# EasyEDA schematic SCH_Honda-GA-Net-Translator.json

## Sheets
1 Power Inlet: TITLE: Honda GA-Net Translator Power; REV: 1.0; Date: 2025-02-28; Sheet: 1/7; Drawn By: Aidan C Franits; Company: AidF Electronics
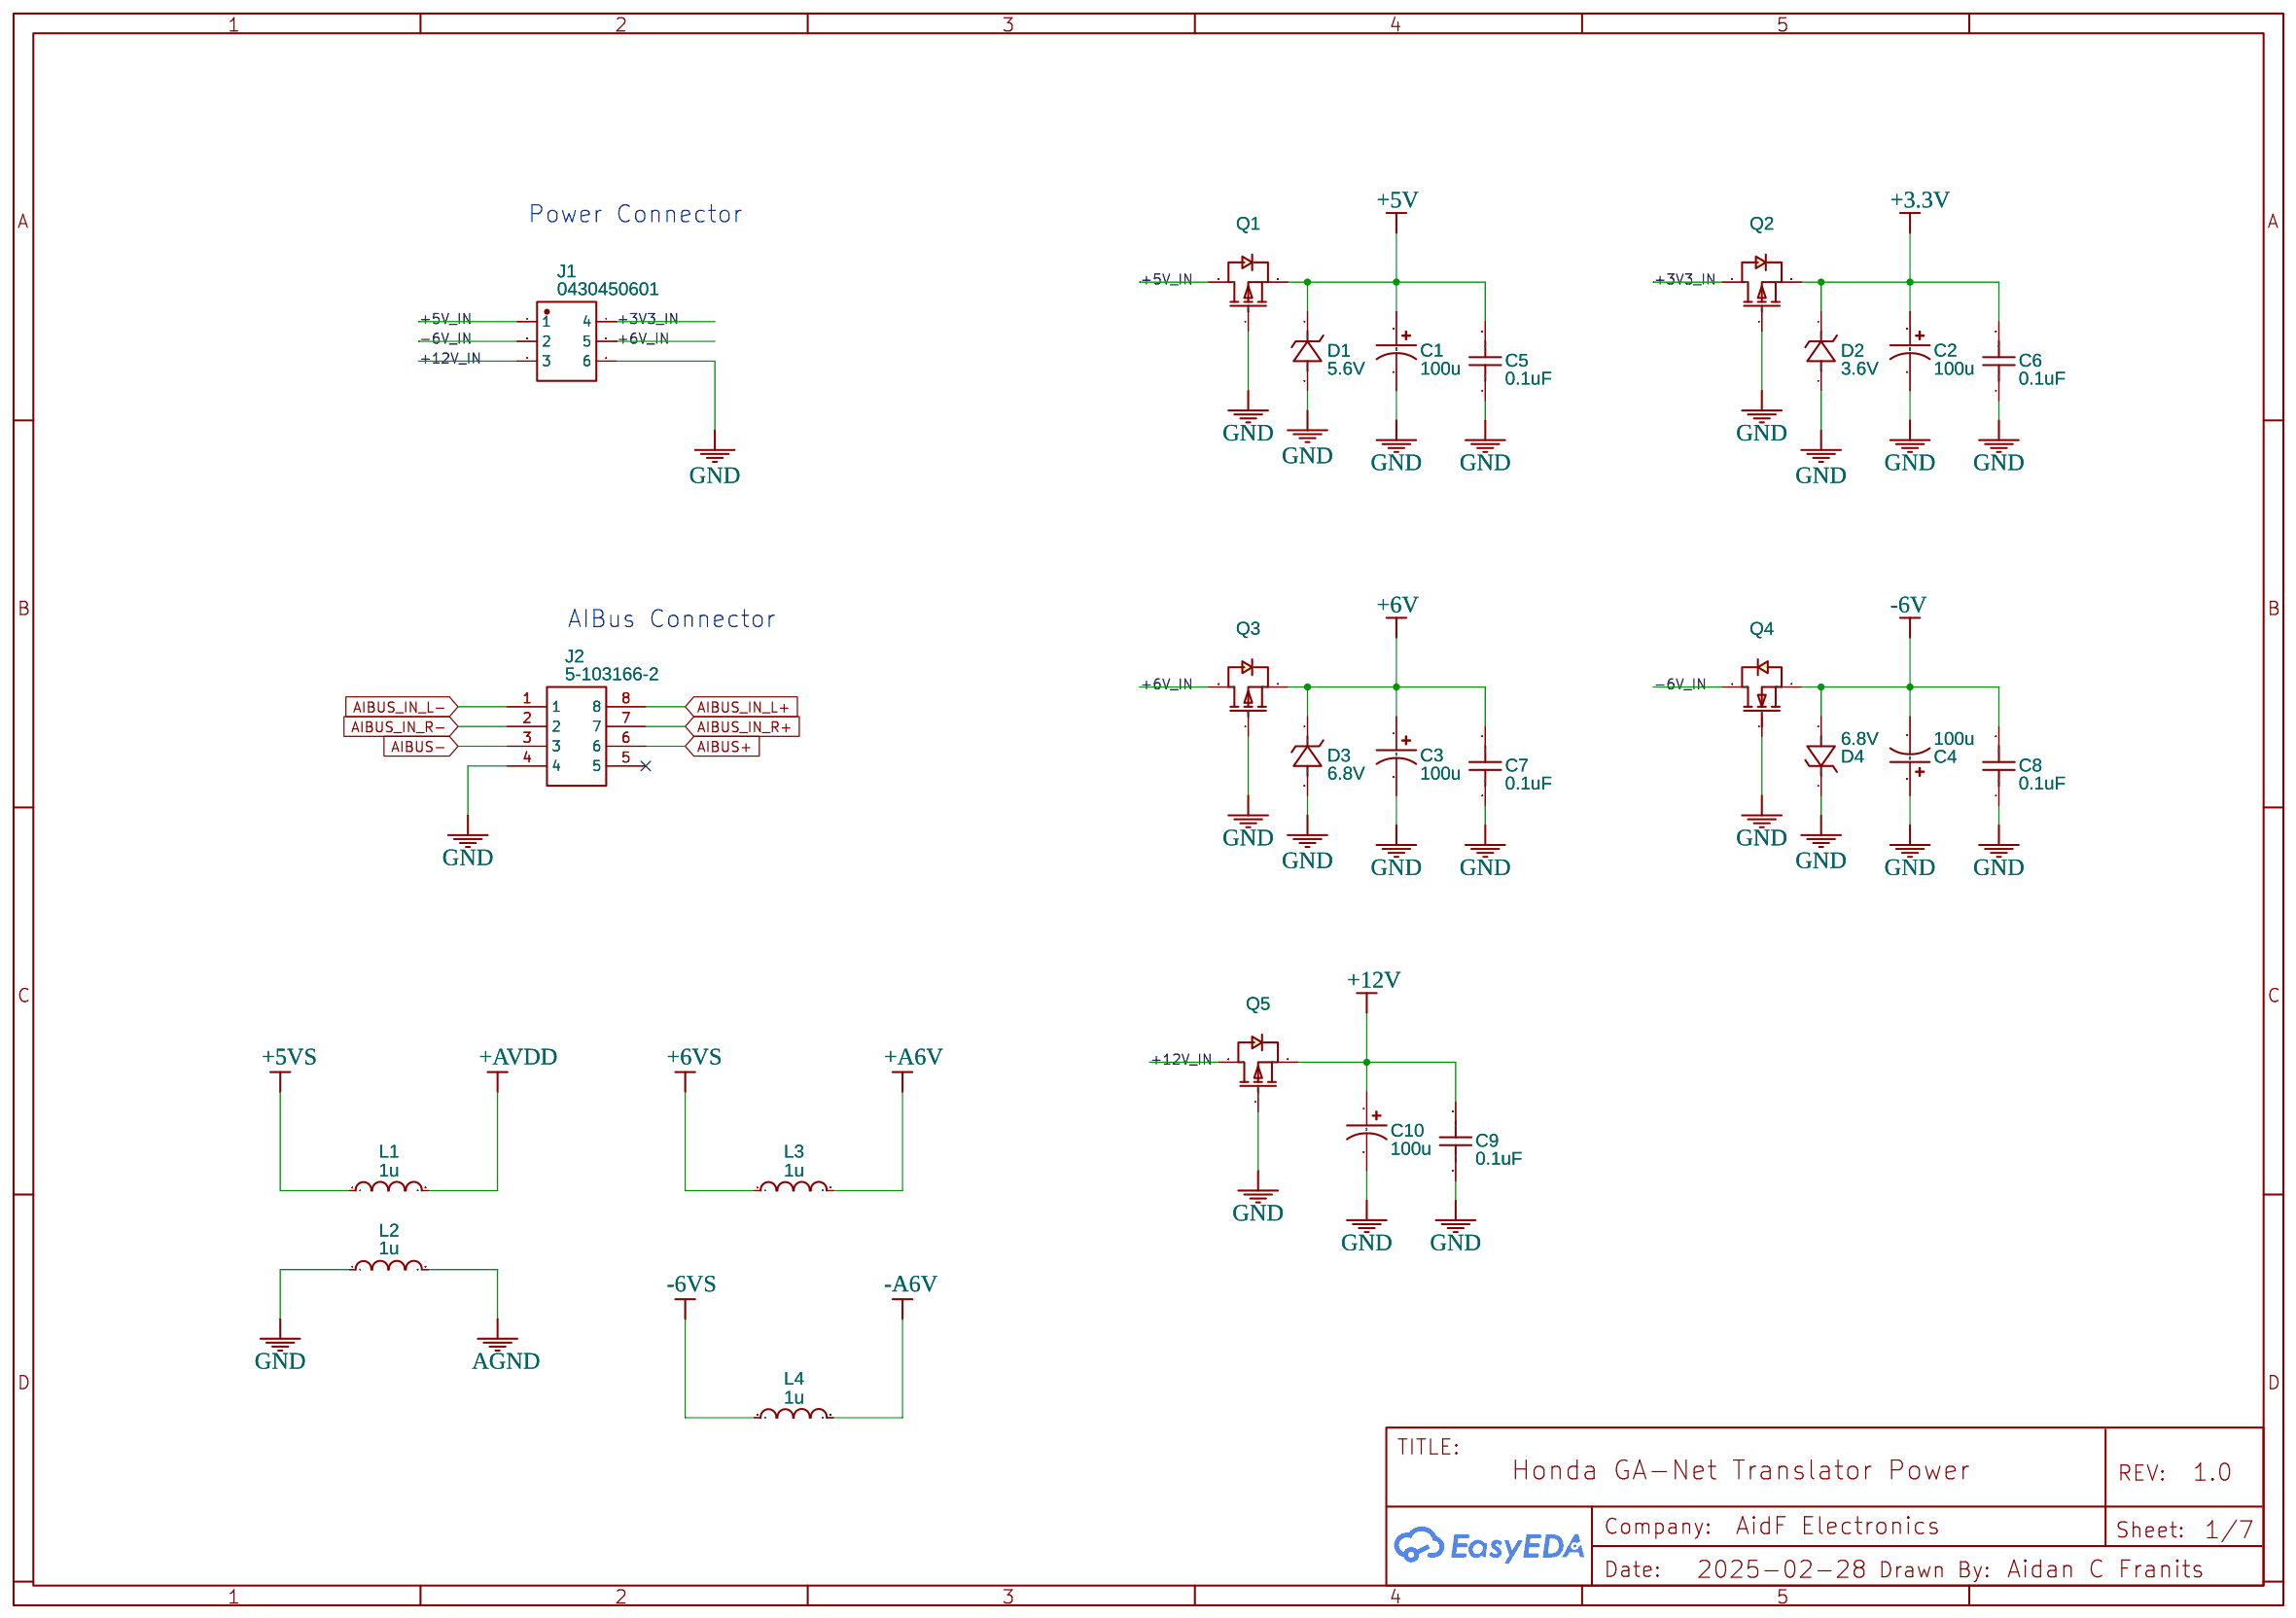
[diagram p0: Power Inlet]
2 Main Controller: TITLE: Honda GA-Net Translator Main Controller; Sheet: 2/7
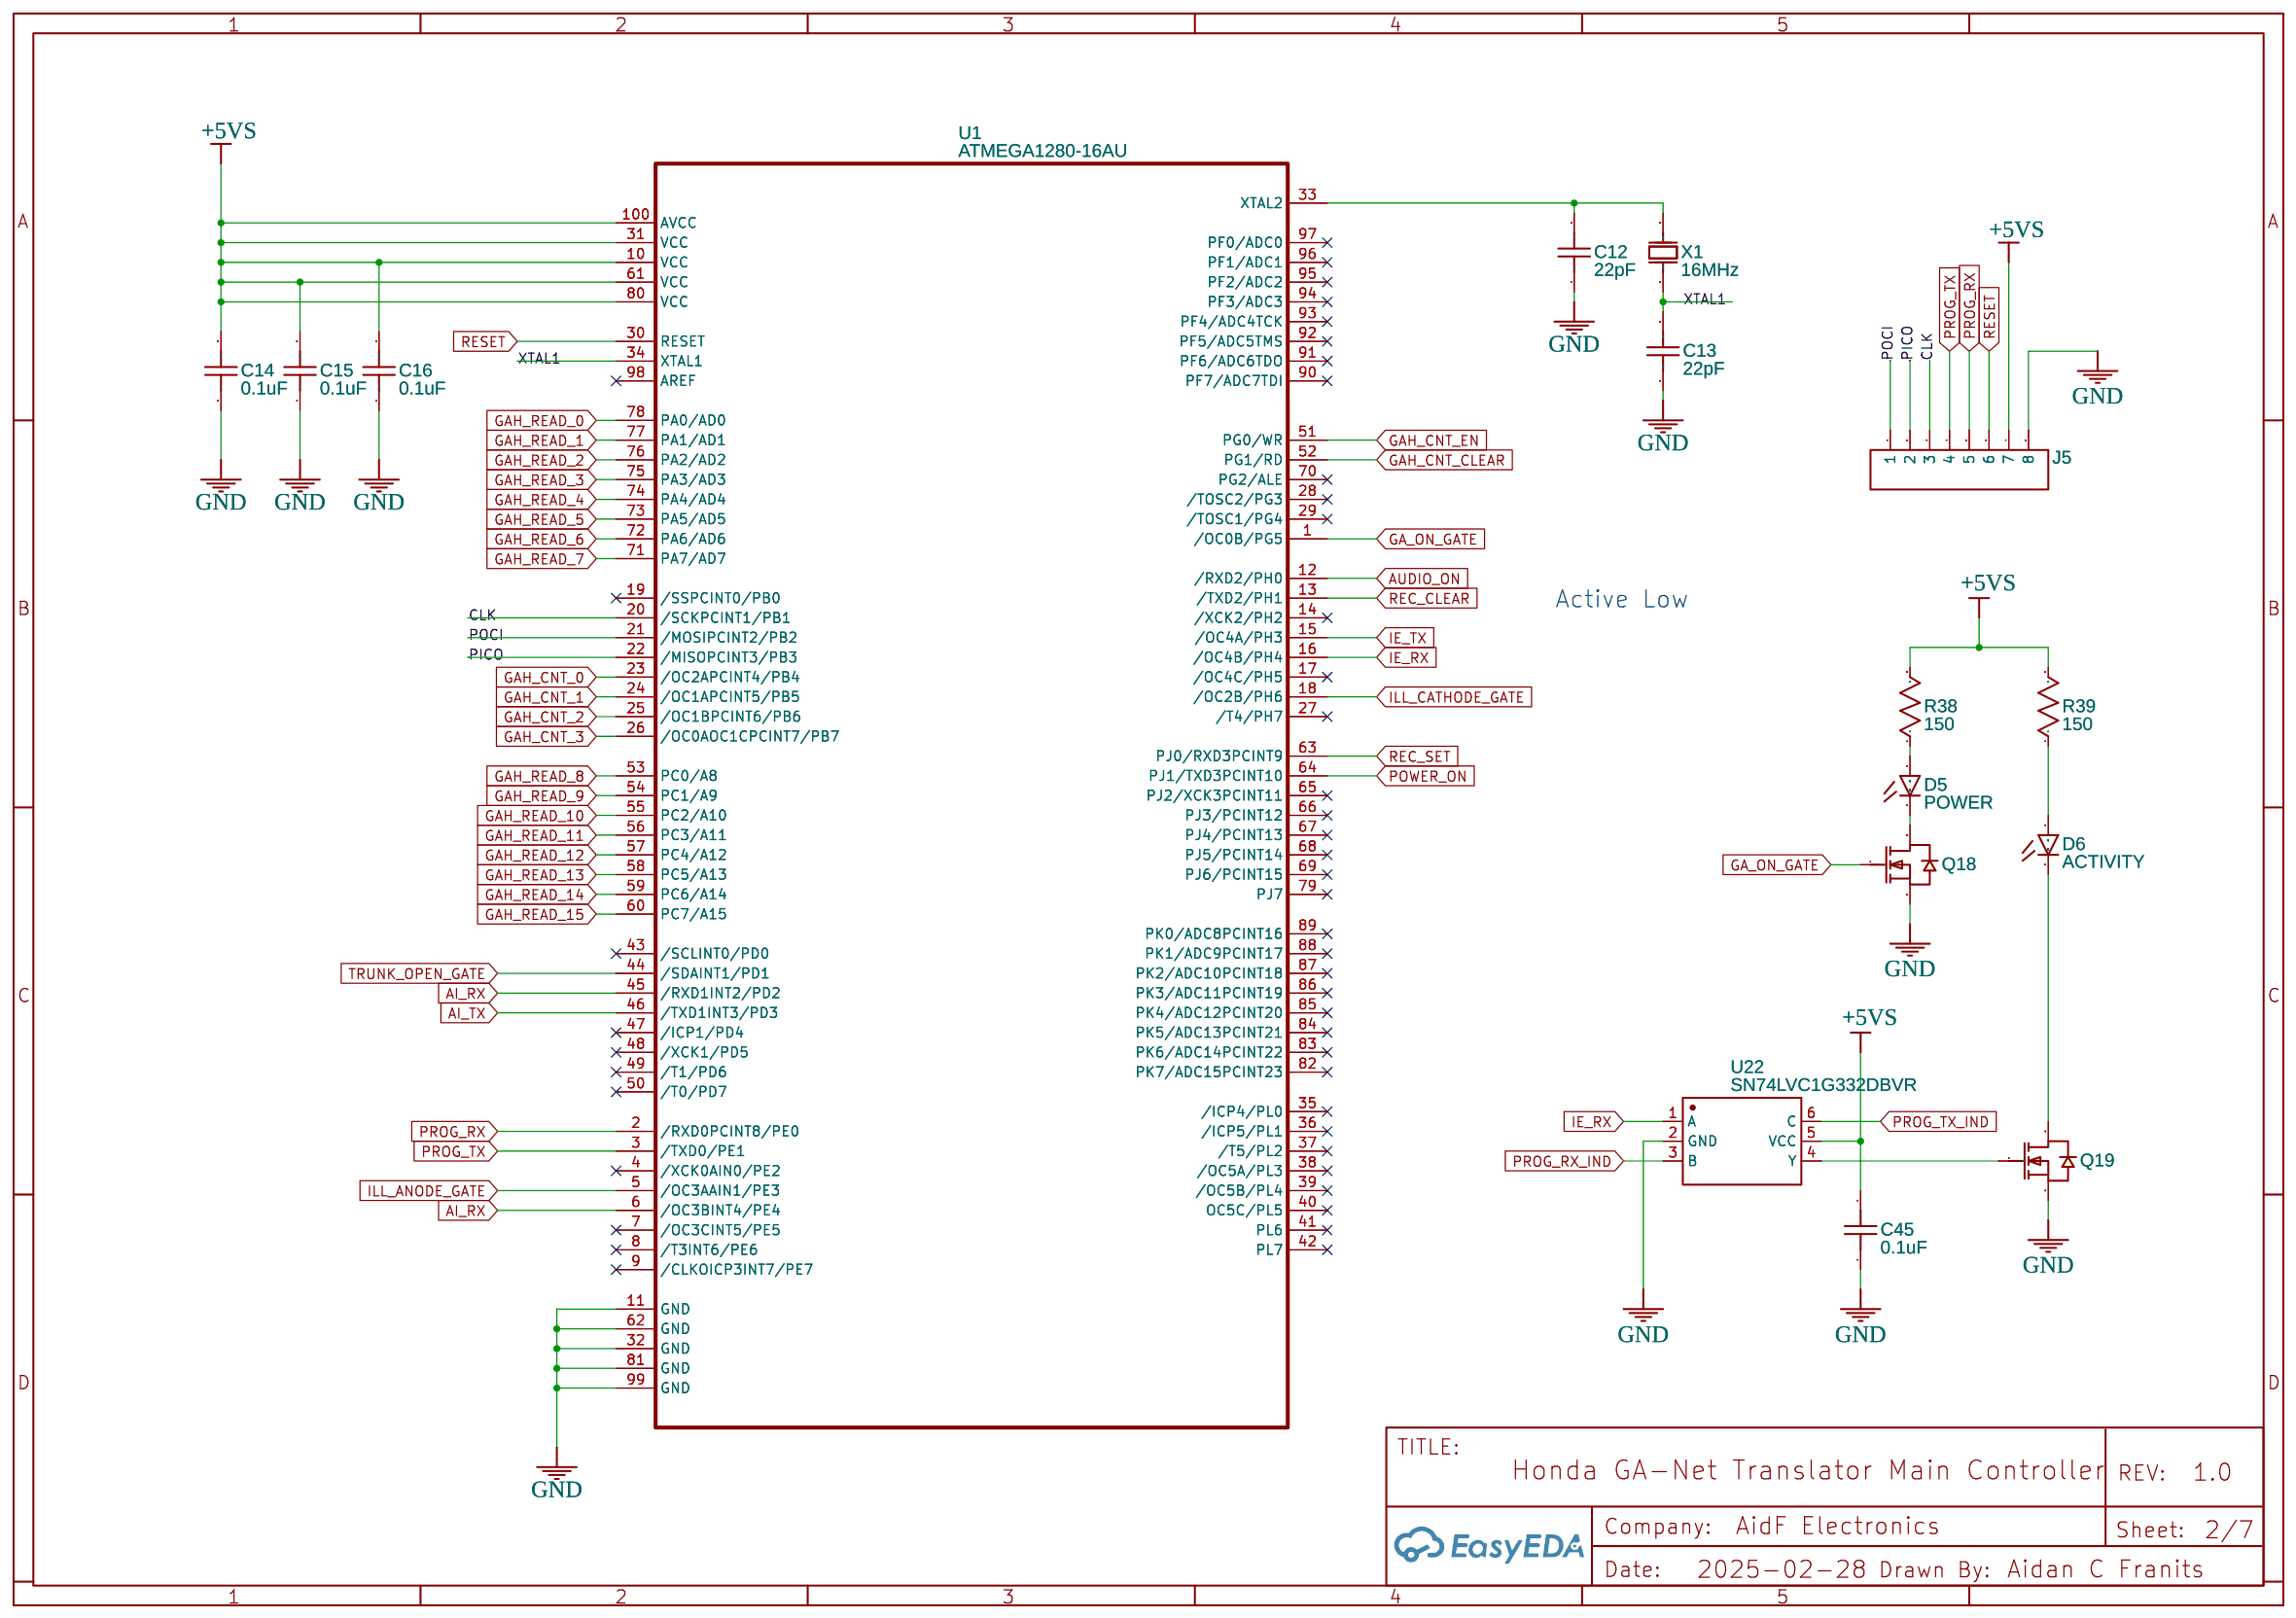
[diagram p1: Main Controller]
3 AIBus Inlet: TITLE: Honda GA-Net Translator AIBus Inlet; Sheet: 3/7
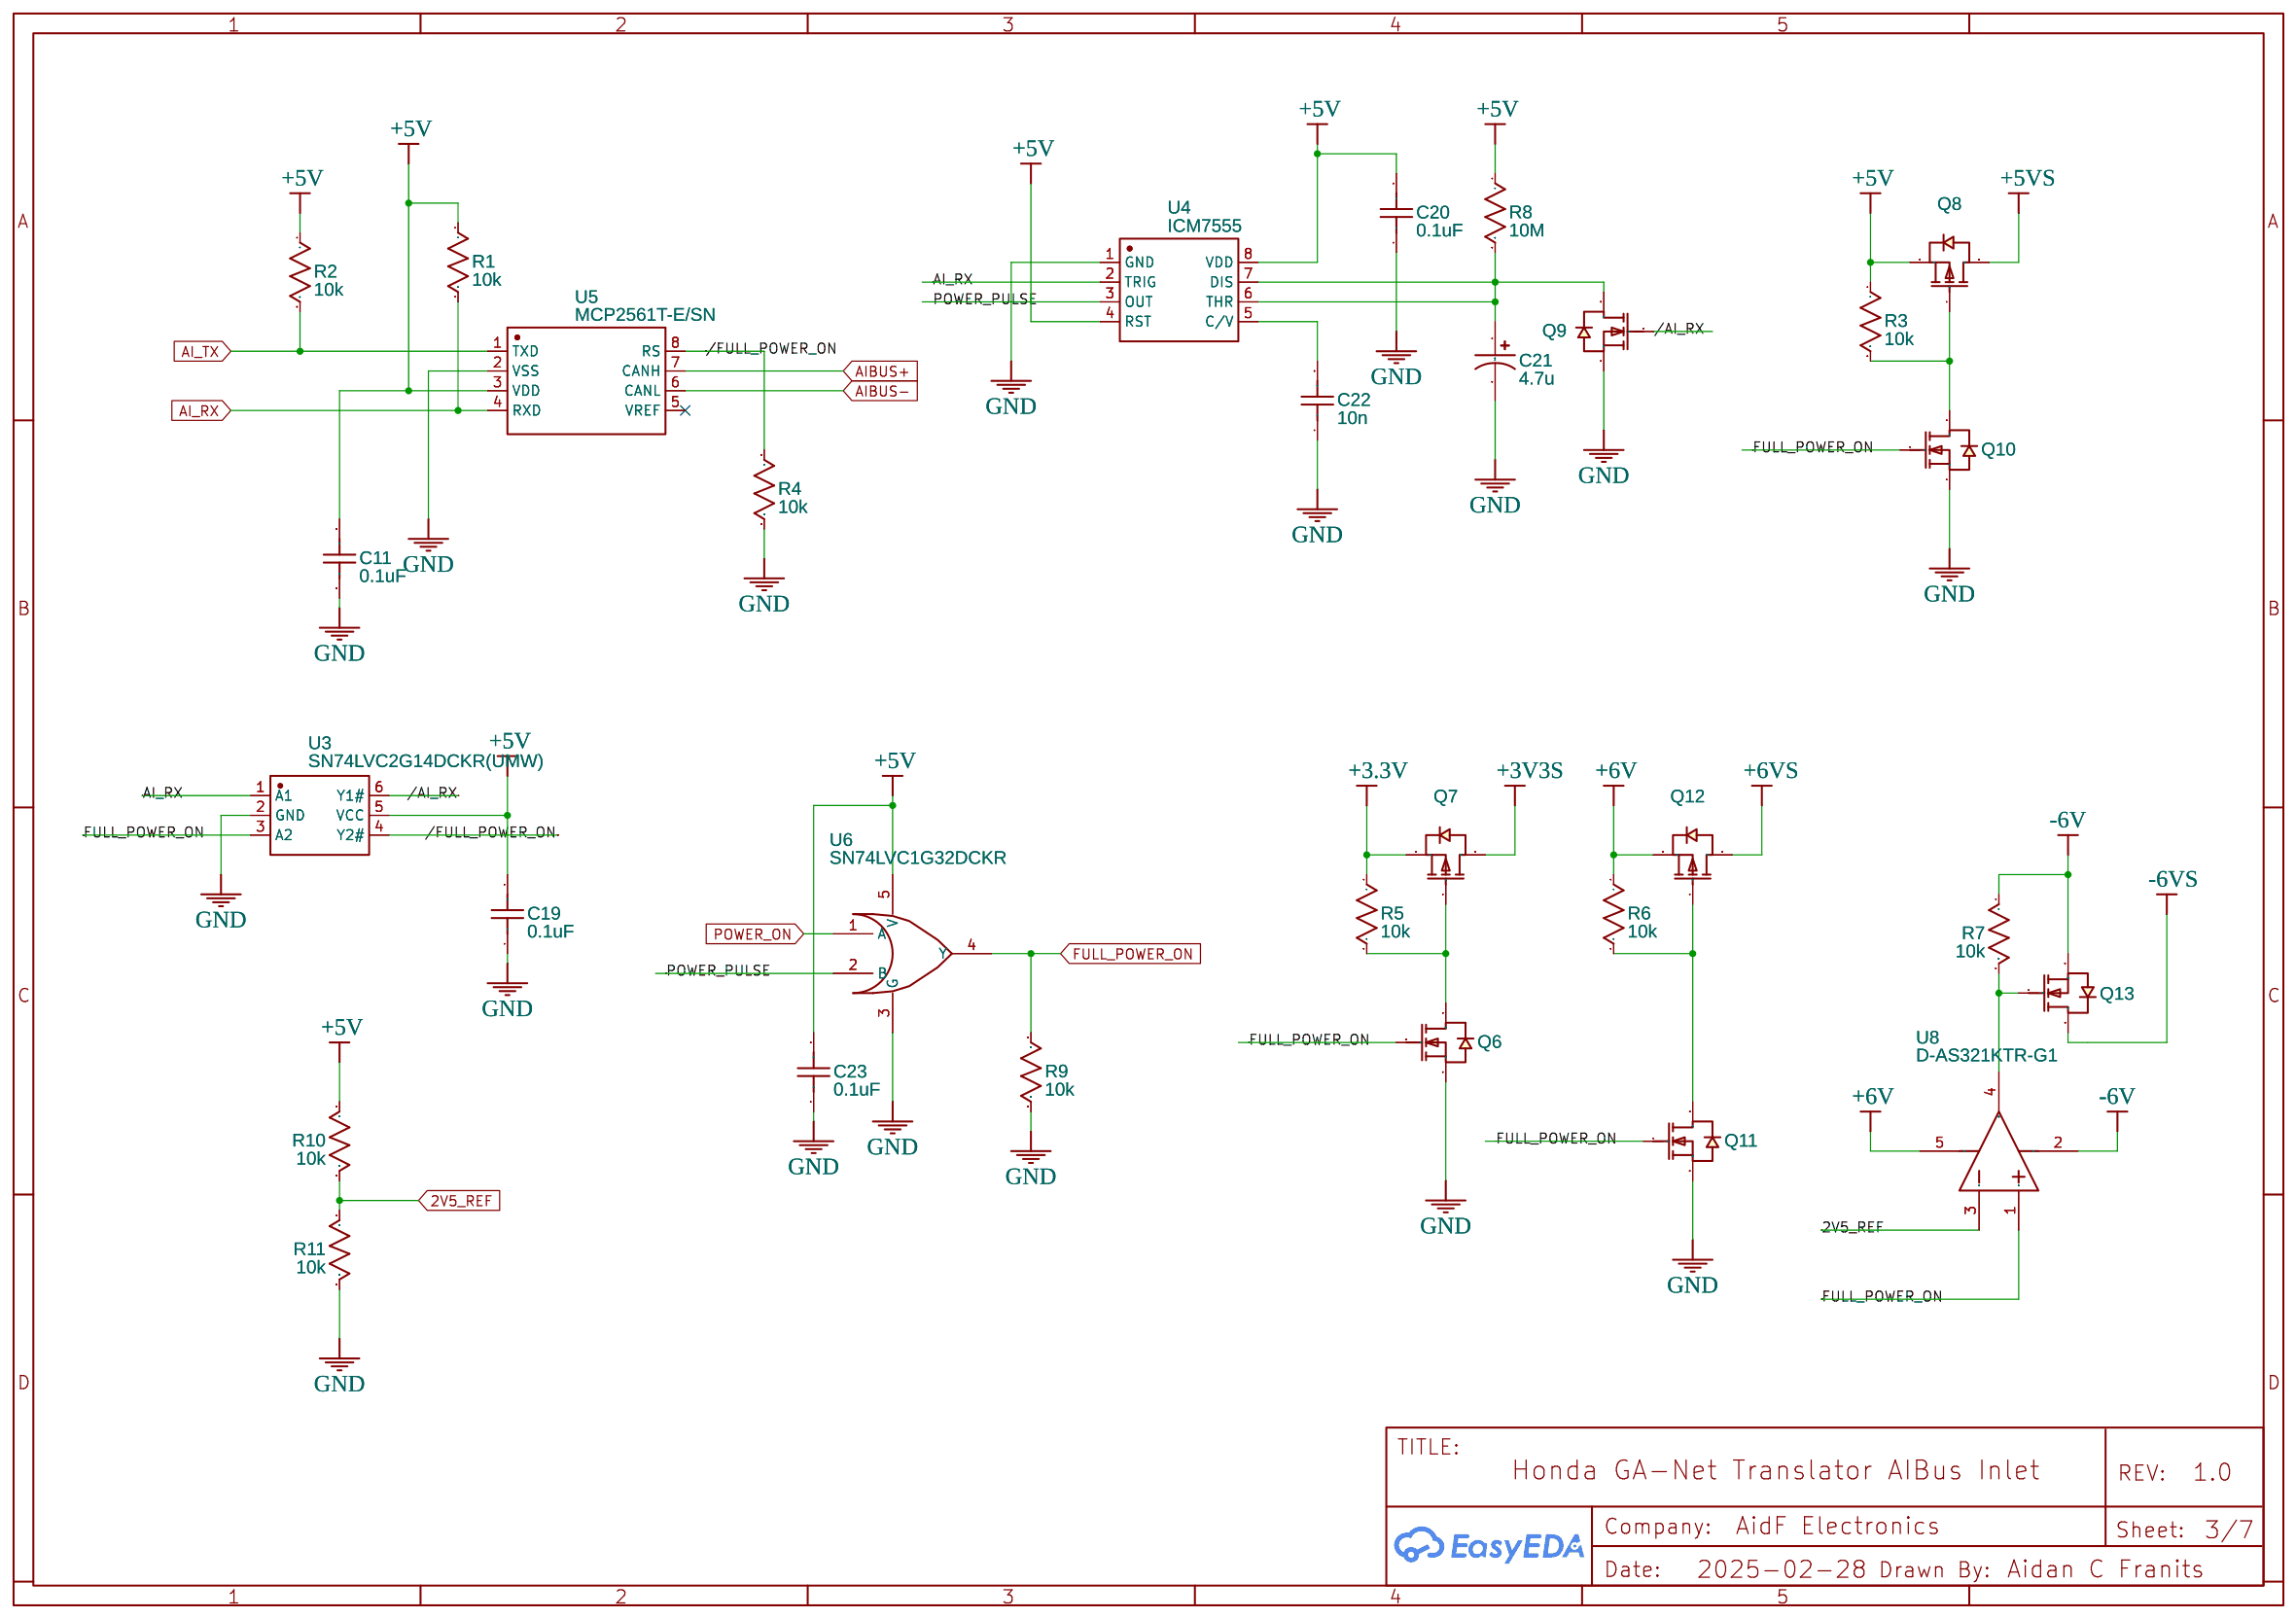
[diagram p2: AIBus Inlet]
4 IEBus Inlet: TITLE: Honda GA-Net Translator IEBus Inlet; Sheet: 4/7
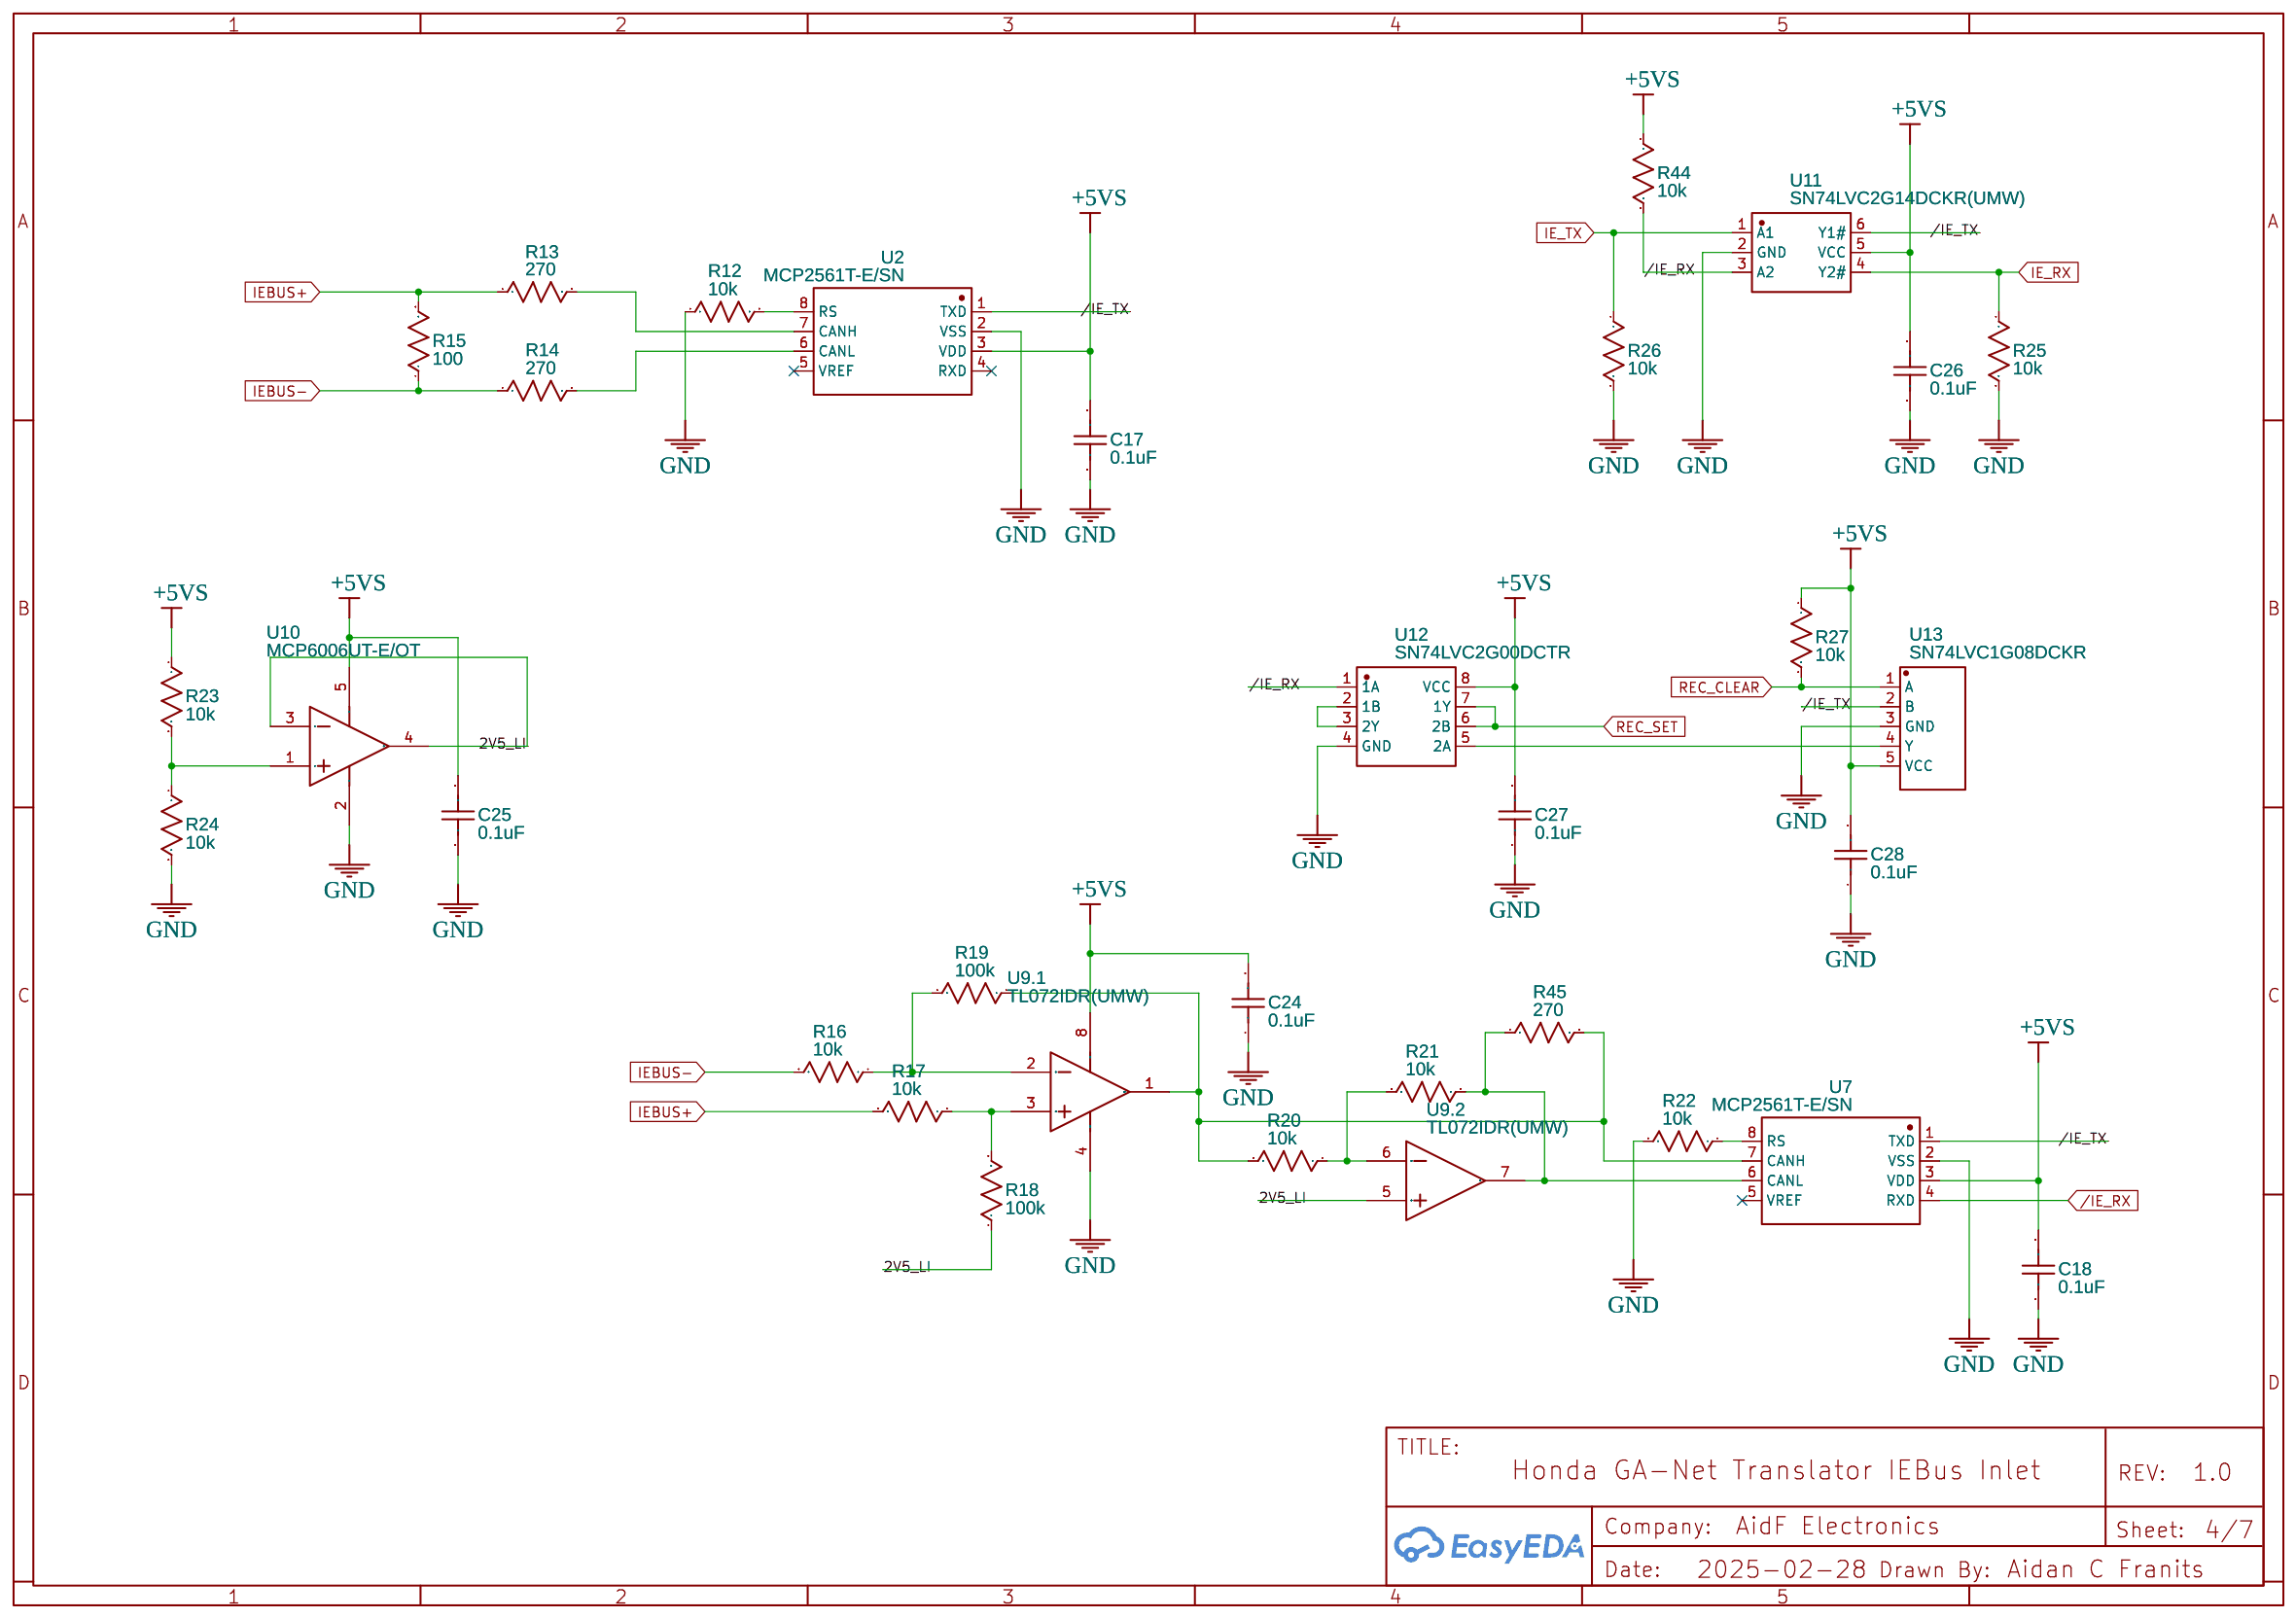
[diagram p3: IEBus Inlet]
5 IEBus Counter: TITLE: Honda GA-Net Translator IEBus Counter; Sheet: 5/7
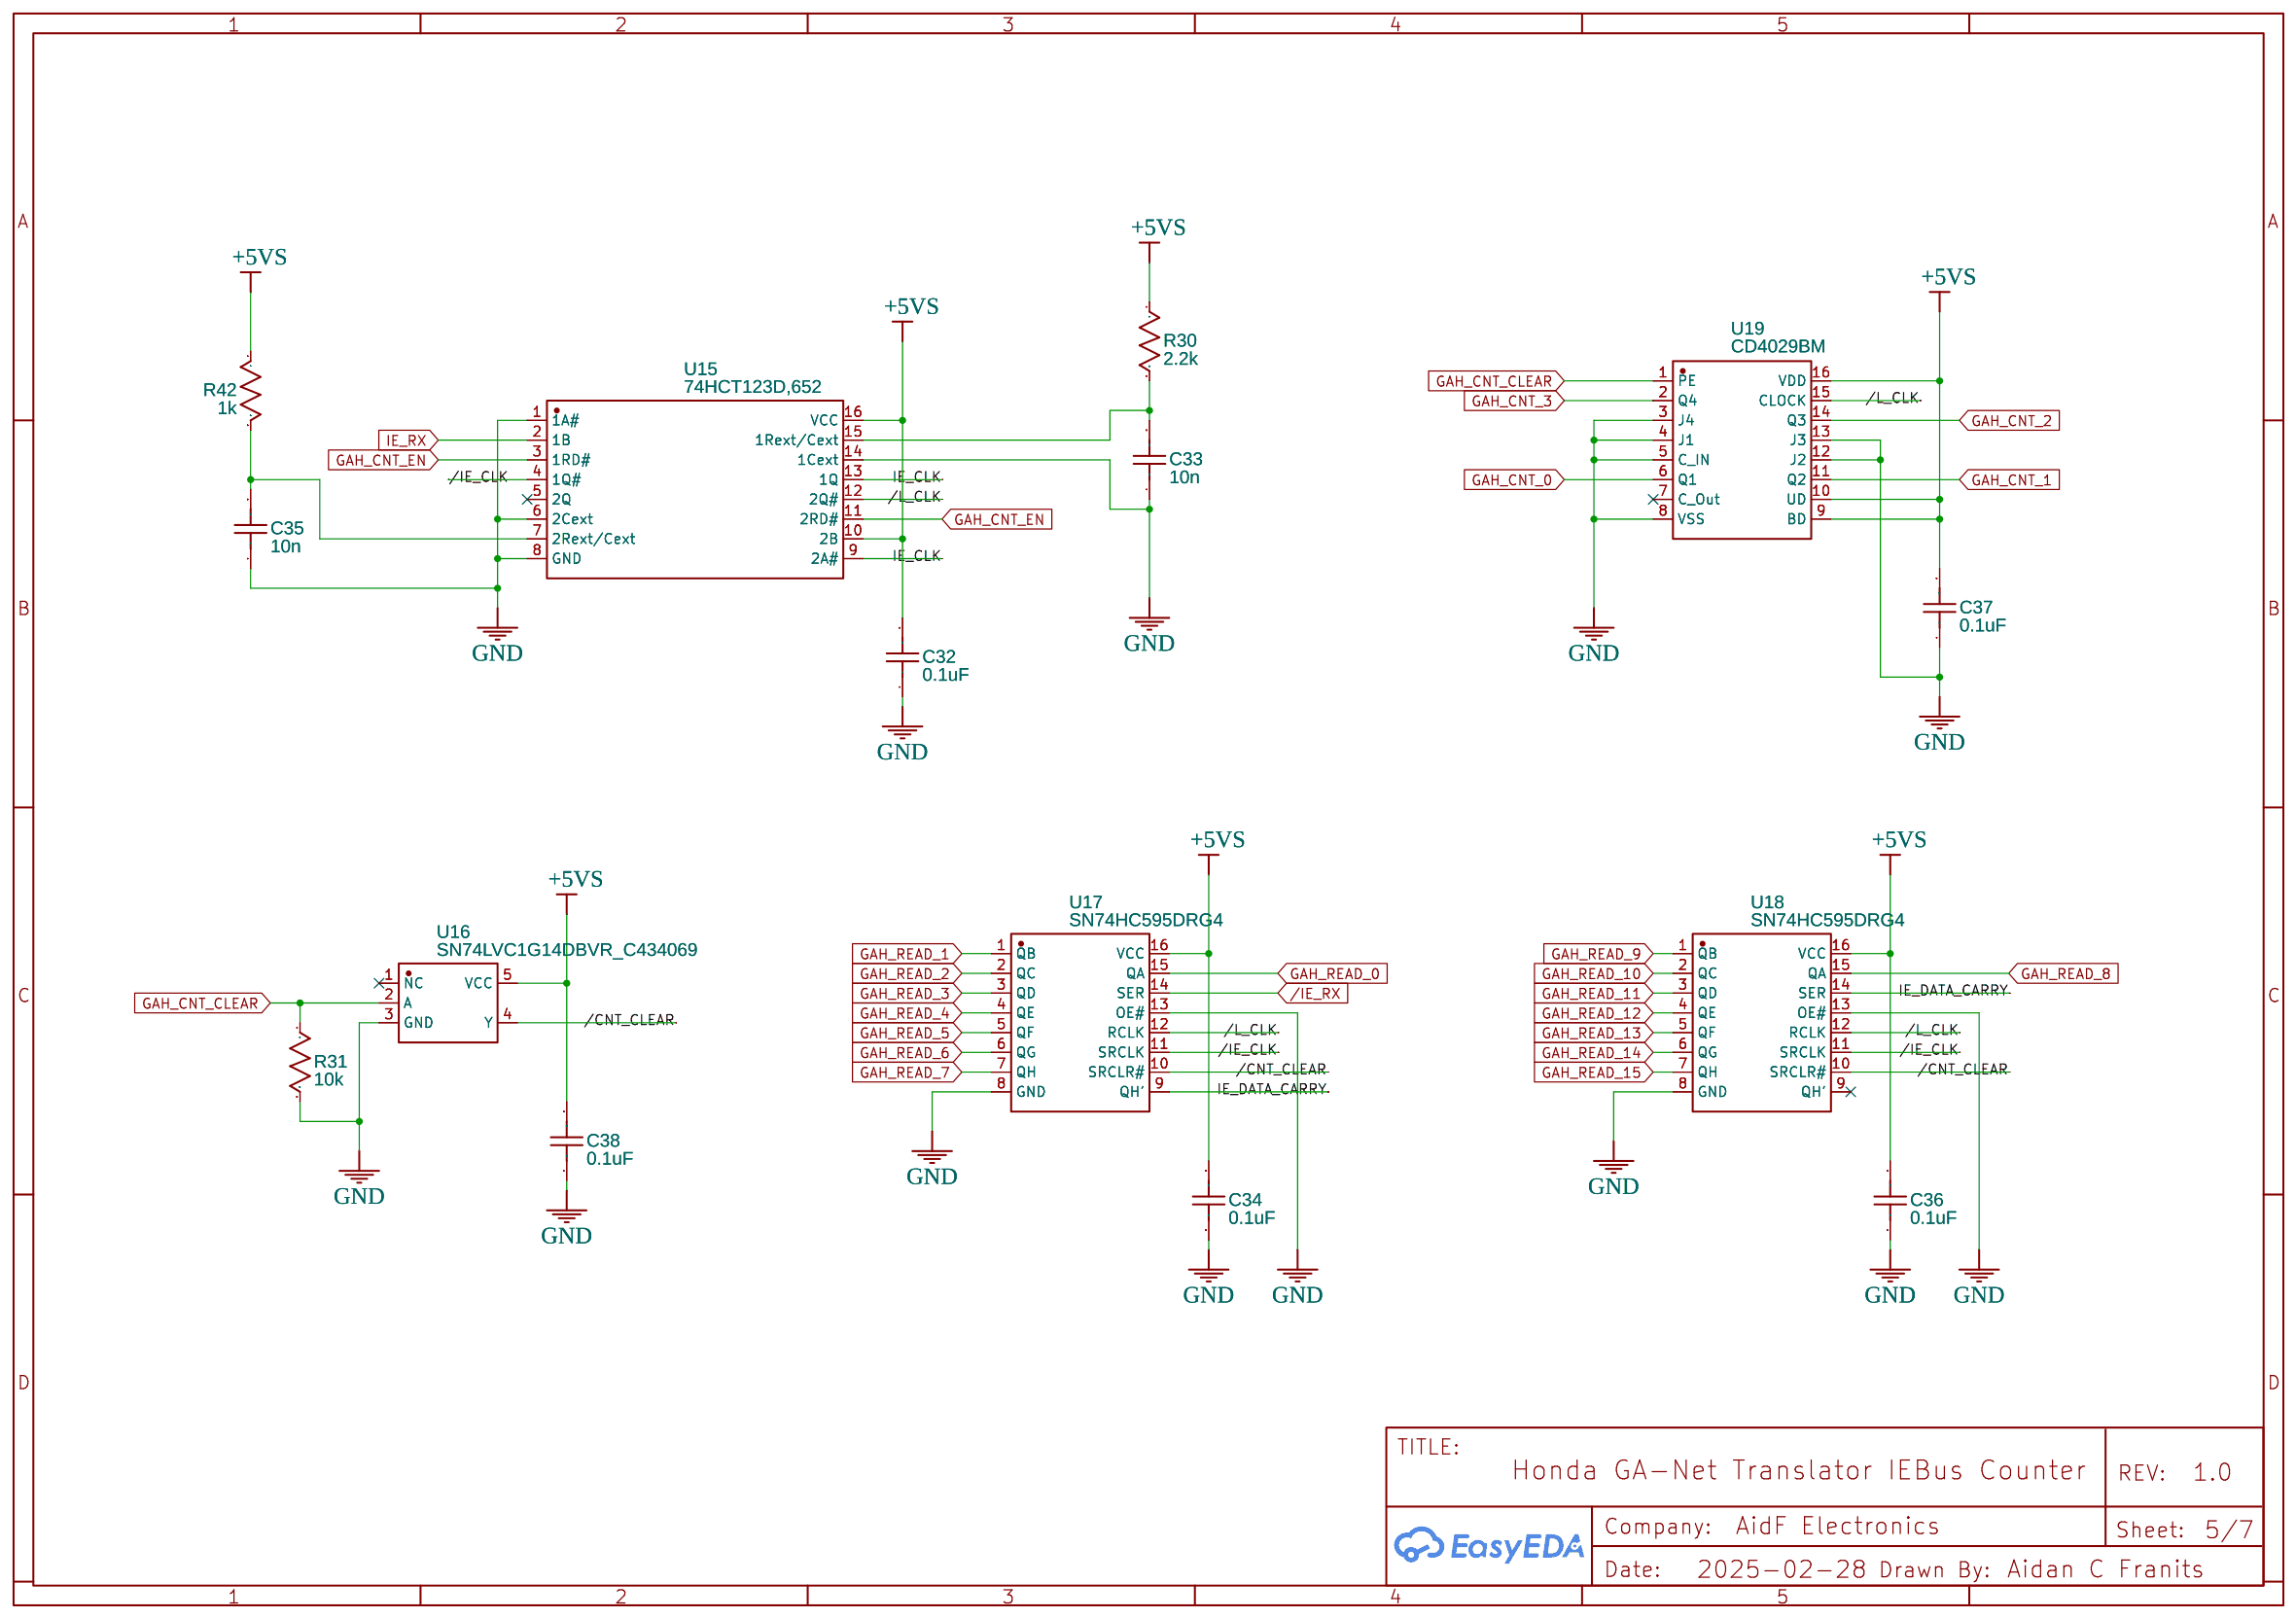
[diagram p4: IEBus Counter]
6 IEBus Outlet: TITLE: Honda GA-Net Translator IEBus Outlet; Sheet: 6/7
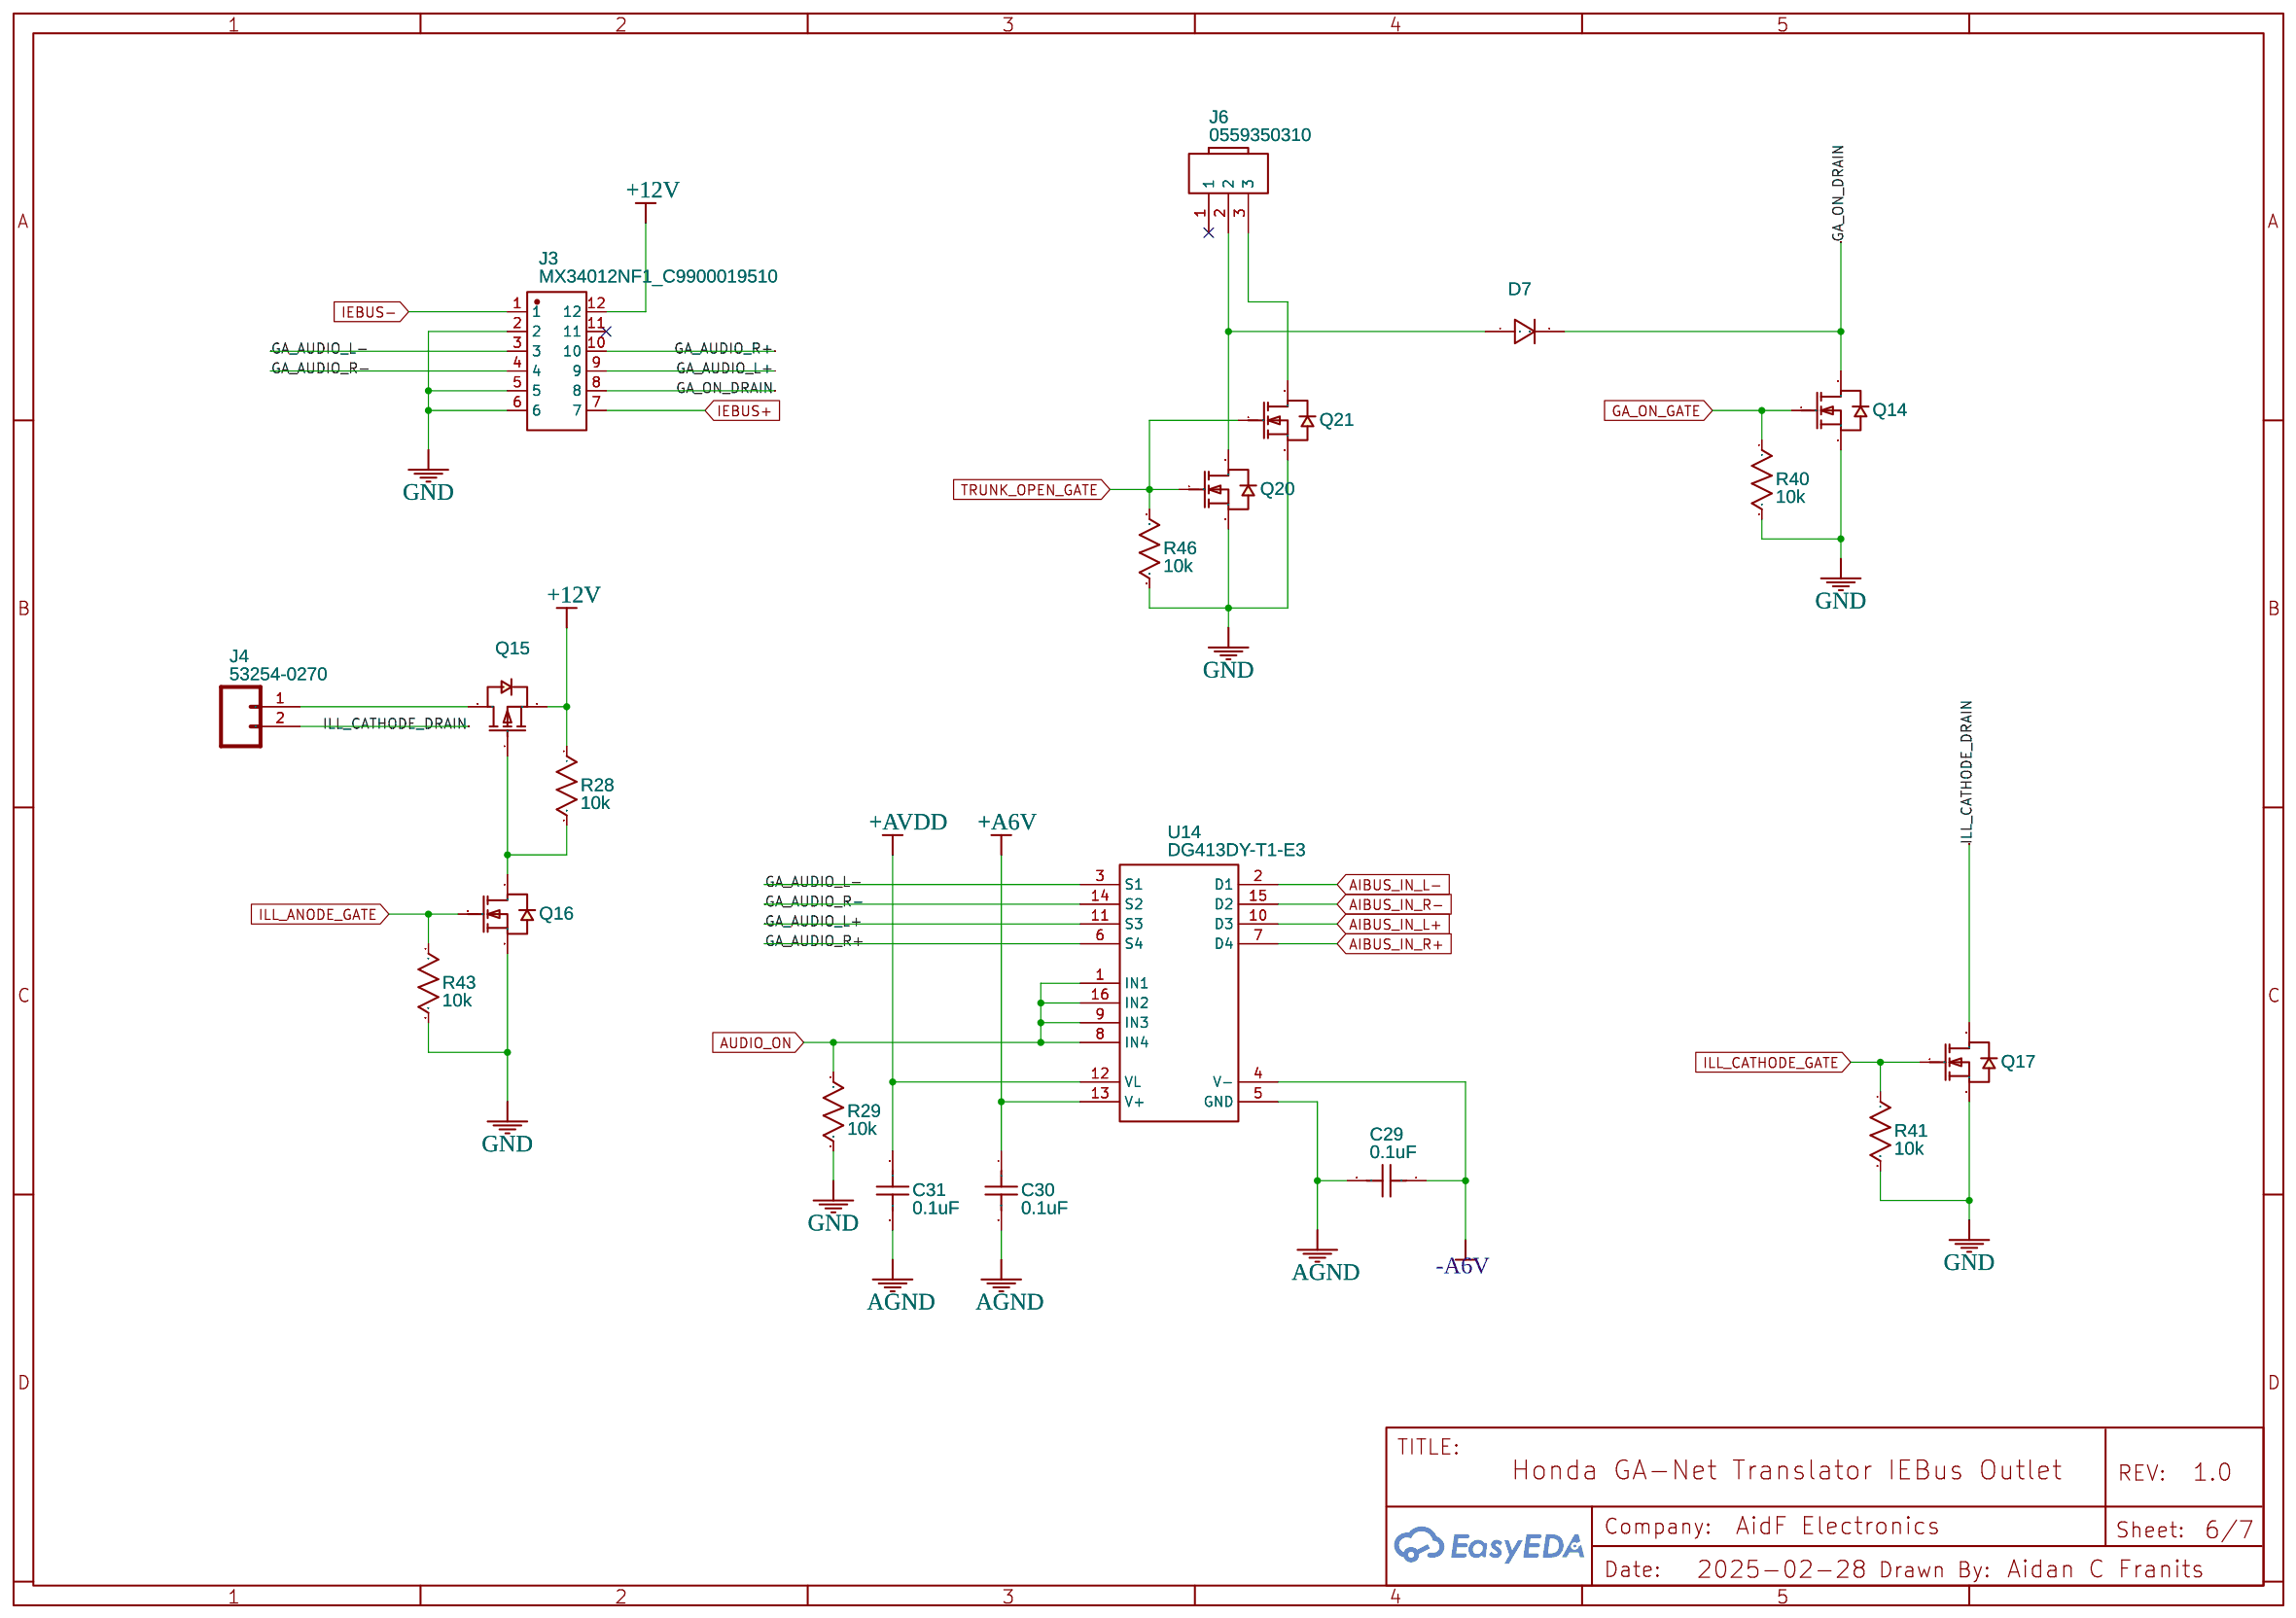
[diagram p5: IEBus Outlet]
7 Programming: TITLE: Honda GA-Net Translator Programming; Date: 2025-03-01; Sheet: 7/7
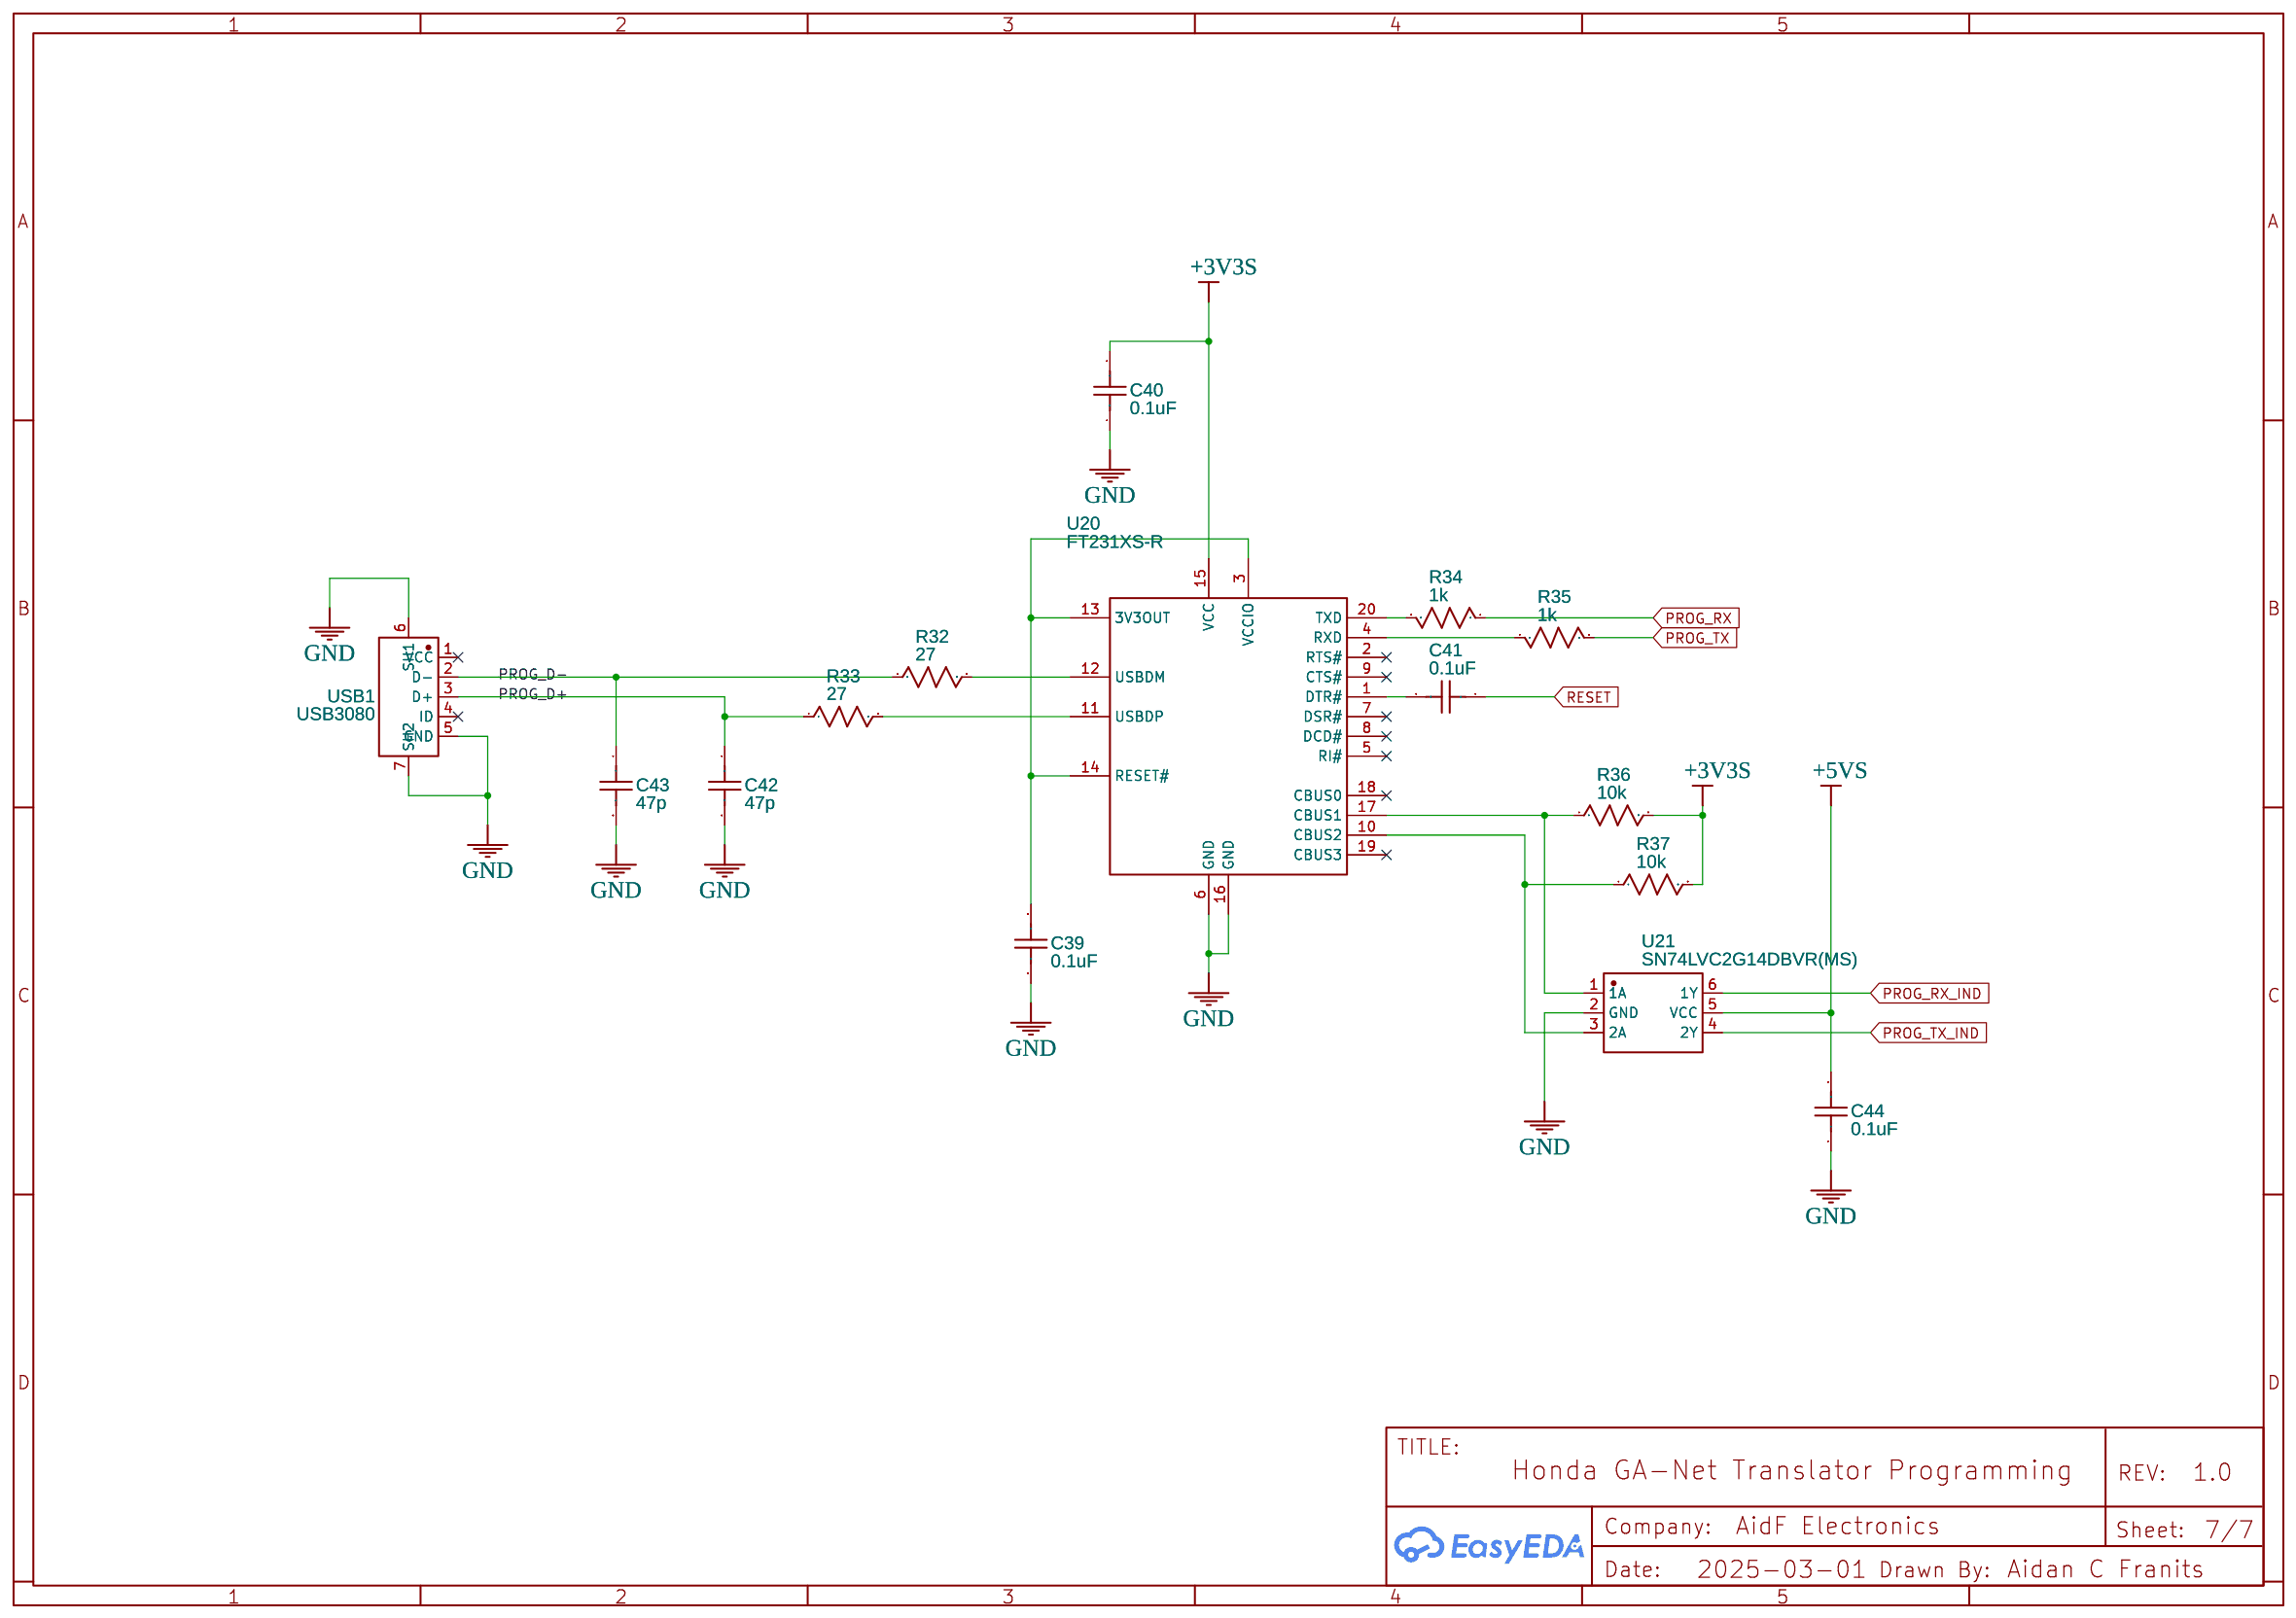
[diagram p6: Programming]

## Parts
sheet AIBus Inlet
C11  0.1uF  [C0603]
C19  0.1uF  [C0603]
C20  0.1uF  [C0603]
C21  4.7u  [CAP-D5.0×F2.0]
C22  10n  [C0603]
C23  0.1uF  [C0603]
Q6  DMN67D8LW-13  [SOT-323-3_L2.2-W1.3-P1.30-LS2.1-BR]
Q7  SI2347DS-T1-GE3  [SOT-23-3_L2.9-W1.3-P1.83-LS2.4-BR-1]
Q8  SI2347DS-T1-GE3  [SOT-23-3_L2.9-W1.3-P1.83-LS2.4-BR-1]
Q9  2N7002  [SOT-23_L2.9-W1.3-P0.95-LS2.4-BR]
Q10  DMN67D8LW-13  [SOT-323-3_L2.2-W1.3-P1.30-LS2.1-BR]
Q11  DMN67D8LW-13  [SOT-323-3_L2.2-W1.3-P1.30-LS2.1-BR]
Q12  SI2347DS-T1-GE3  [SOT-23-3_L2.9-W1.3-P1.83-LS2.4-BR-1]
Q13  2N7002  [SOT-23_L2.9-W1.3-P0.95-LS2.4-BR]
R1  10k  [R0603]
R2  10k  [R0603]
R3  10k  [R0603]
R4  10k  [R0603]
R5  10k  [R0603]
R6  10k  [R0603]
R7  10k  [R0603]
R8  10M  [R0603]
R9  10k  [R0603]
R10  10k  [R0603]
R11  10k  [R0603]
U3  SN74LVC2G14DCKR(UMW)  [SC-70-6_L2.0-W1.3-P0.65-LS2.2-BL]
U4  ICM7555  [SOIC-8]
U5  MCP2561T-E/SN  [SOIC-8_L4.9-W3.9-P1.27-LS6.0-BL-2]
U6  SN74LVC1G32DCKR  [SC-70-5_L2.1-W1.3-P0.65-LS2.1-BL]
U8  D-AS321KTR-G1  [SOT-23-5_L2.9-W1.6-P0.95-LS2.8-BL]
sheet IEBus Counter
C32  0.1uF  [C0603]
C33  10n  [C0603]
C34  0.1uF  [C0603]
C35  10n  [C0603]
C36  0.1uF  [C0603]
C37  0.1uF  [C0603]
C38  0.1uF  [C0603]
R30  2.2k  [R0603]
R31  10k  [R0603]
R42  1k  [R0603]
U15  74HCT123D,652  [SOIC-16_L9.9-W3.9-P1.27-LS6.0-BL]
U16  SN74LVC1G14DBVR_C434069  [SOT-23-5_L3.0-W1.7-P0.95-LS2.8-BR]
U17  SN74HC595DRG4  [SOIC-16_L9.9-W3.9-P1.27-LS6.0-BL]
U18  SN74HC595DRG4  [SOIC-16_L9.9-W3.9-P1.27-LS6.0-BL]
U19  CD4029BM  [SOIC-16_L9.9-W3.9-P1.27-LS6.0-BL]
sheet IEBus Inlet
C17  0.1uF  [C0603]
C18  0.1uF  [C0603]
C24  0.1uF  [C0603]
C25  0.1uF  [C0603]
C26  0.1uF  [C0603]
C27  0.1uF  [C0603]
C28  0.1uF  [C0603]
R12  10k  [R0603]
R13  270  [R0805]
R14  270  [R0805]
R15  100  [R0805]
R16  10k  [R0603]
R17  10k  [R0603]
R18  100k  [R0603]
R19  100k  [R0603]
R20  10k  [R0603]
R21  10k  [R0603]
R22  10k  [R0603]
R23  10k  [R0603]
R24  10k  [R0603]
R25  10k  [R0603]
R26  10k  [R0603]
R27  10k  [R0603]
R44  10k  [R0603]
R45  270  [R0805]
U2  MCP2561T-E/SN  [SOIC-8_L4.9-W3.9-P1.27-LS6.0-BL-2]
U7  MCP2561T-E/SN  [SOIC-8_L4.9-W3.9-P1.27-LS6.0-BL-2]
U9  TL072IDR(UMW)  [SOIC-8_L4.9-W3.9-P1.27-LS6.0-BL]  (sections 1,2)
U10  MCP6006UT-E/OT  [SOT-23-5_L3.0-W1.6-P0.95-LS2.8-BL]
U11  SN74LVC2G14DCKR(UMW)  [SC-70-6_L2.0-W1.3-P0.65-LS2.2-BL]
U12  SN74LVC2G00DCTR  [SSOP-8_L3.0-W2.8-P0.65-LS4.0-BL-1]
U13  SN74LVC1G08DCKR  [SC-70-5_L2.1-W1.3-P0.65-LS2.1-BR]
sheet IEBus Outlet
C29  0.1uF  [C0603]
C30  0.1uF  [C0603]
C31  0.1uF  [C0603]
D7  SD103AWS-TP  [SOD-323_L1.8-W1.3-LS2.6-FD]
J3  MX34012NF1_C9900019510  [CONN-TH_MX34012NF1]
J4  53254-0270  [MOLEX_53254-0270]
J6  0559350310  [0559350310]
Q14  DMN67D8LW-13  [SOT-323-3_L2.2-W1.3-P1.30-LS2.1-BR]
Q15  SI2347DS-T1-GE3  [SOT-23-3_L2.9-W1.3-P1.83-LS2.4-BR-1]
Q16  DMN67D8LW-13  [SOT-323-3_L2.2-W1.3-P1.30-LS2.1-BR]
Q17  2N7002  [SOT-23_L2.9-W1.3-P0.95-LS2.4-BR]
Q20  DMN67D8LW-13  [SOT-323-3_L2.2-W1.3-P1.30-LS2.1-BR]
Q21  DMN67D8LW-13  [SOT-323-3_L2.2-W1.3-P1.30-LS2.1-BR]
R28  10k  [R0603]
R29  10k  [R0603]
R40  10k  [R0603]
R41  10k  [R0603]
R43  10k  [R0603]
R46  10k  [R0603]
U14  DG413DY-T1-E3  [SOIC-16_L9.9-W3.9-P1.27-LS6.0-BL]
sheet Main Controller
C12  22pF  [C0603]
C13  22pF  [C0603]
C14  0.1uF  [C0603]
C15  0.1uF  [C0603]
C16  0.1uF  [C0603]
C45  0.1uF  [C0603]
D5  POWER  [LED-TH_BD5.0-P2.54-FD]
D6  ACTIVITY  [LED-TH_BD5.0-P2.54-FD]
J5  HDR-M-2.54_1x8  [HDR-M-2.54_2X4]
Q18  DMN67D8LW-13  [SOT-323-3_L2.2-W1.3-P1.30-LS2.1-BR]
Q19  DMN67D8LW-13  [SOT-323-3_L2.2-W1.3-P1.30-LS2.1-BR]
R38  150  [R0603]
R39  150  [R0603]
U1  ATMEGA1280-16AU  [ATMEGA2560-16AU]
U22  SN74LVC1G332DBVR  [SOT-23-6_L2.9-W1.6-P0.95-LS2.8-BR]
X1  16MHz  [HC-49US-SMD_L7.0-W4.1]
sheet Power Inlet
C1  100u  [CAP-D6.3×F2.5]
C2  100u  [CAP-D6.3×F2.5]
C3  100u  [CAP-D6.3×F2.5]
C4  100u  [CAP-D6.3×F2.5]
C5  0.1uF  [C0603]
C6  0.1uF  [C0603]
C7  0.1uF  [C0603]
C8  0.1uF  [C0603]
C9  0.1uF  [C0603]
C10  100u  [CAP-D6.3×F2.5]
D1  5.6V  [SOD-123_L2.7-W1.6-LS3.7-RD-A]
D2  3.6V  [SOD-123_L2.7-W1.6-LS3.7-RD-A]
D3  6.8V  [SOD-123_L2.7-W1.6-LS3.7-RD-A]
D4  6.8V  [SOD-123_L2.7-W1.6-LS3.7-RD-A]
J1  0430450601  [0430450601]
J2  5-103166-2  [CONN-TH_8P-P2.54_5-103166-2]
L1  1u  [L0603]
L2  1u  [L0603]
L3  1u  [L0603]
L4  1u  [L0603]
Q1  SI2347DS-T1-GE3  [SOT-23-3_L2.9-W1.3-P1.83-LS2.4-BR-1]
Q2  SI2347DS-T1-GE3  [SOT-23-3_L2.9-W1.3-P1.83-LS2.4-BR-1]
Q3  SI2347DS-T1-GE3  [SOT-23-3_L2.9-W1.3-P1.83-LS2.4-BR-1]
Q4  2N7002  [SOT-23_L2.9-W1.3-P0.95-LS2.4-BR]
Q5  SI2347DS-T1-GE3  [SOT-23-3_L2.9-W1.3-P1.83-LS2.4-BR-1]
sheet Programming
C39  0.1uF  [C0603]
C40  0.1uF  [C0603]
C41  0.1uF  [C0603]
C42  47p  [C0603]
C43  47p  [C0603]
C44  0.1uF  [C0603]
R32  27  [R0603]
R33  27  [R0603]
R34  1k  [R0603]
R35  1k  [R0603]
R36  10k  [R0603]
R37  10k  [R0603]
U20  FT231XS-R  [SSOP-20_L8.6-W3.9-P0.64-LS6.0-BL]
U21  SN74LVC2G14DBVR(MS)  [SOT-23-6_L2.9-W1.6-P0.95-LS2.8-BR]
USB1  USB3080  [USB3080]

## Library data of the parts
C5-C9 C11 C14-C20 C23-C32 C34 C36-C41 C44 C45 = C_0603_US: Supplier Part: 1292-1392-1-ND; Supplier: Digi-Key; Contributor: LCEDA_Lib; Manufacturer Part: 0603B104K101CT; Manufacturer: Walsin Technology Corporation
C21 = CE_TH_D5.0×F2.0_US: Supplier Part: 732-8818-1-ND; Supplier: Digi-Key; Contributor: LCEDA_Lib; Manufacturer Part: 860020472001; Manufacturer: Würth Elektronik
C22 C33 C35 = C_0603_US: Supplier Part: 490-4781-1-ND; Supplier: Digi-Key; Contributor: LCEDA_Lib; Manufacturer Part: GCM188R72A103KA37D; Manufacturer: Murata Electronics
Q6 Q10 Q11 Q14 Q16 Q18-Q21 = 2N7002: Supplier: Digi-Key; Manufacturer: Diodes Incorporated; Supplier Part: DMN67D8LW-13DICT-ND; Contributor: LCEDA_Lib
Q1-Q3 Q5 Q7 Q8 Q12 Q15 = IRF5210: Supplier: Digi-Key; Manufacturer: Vishay Siliconix; Supplier Part: SI2347DS-T1-GE3CT-ND; Contributor: LCEDA_Lib
Q4 Q9 Q13 Q17 = 2N7002: Supplier: Digi-Key; Manufacturer: Diodes Incorporated; Manufacturer Part: DMN3404L-7; image: //image.lceda.cn/szlcsc/C65189.jpg; Supplier Part: DMN3404LDICT-ND; Paste Type: expand; Contributor: LCEDA_Lib
R1-R7 R9-R12 R16 R17 R20-R29 R31 R36 R37 R40 R41 R43 R44 R46 = R_0603_US: Supplier Part: RNCP0603FTD10K0CT-ND; Supplier: Digi-Key; Contributor: LCEDA_Lib; Manufacturer Part: RNCP0603FTD10K0; Manufacturer: Stackpole Electronics Inc
R8 = R_0603_US: Supplier Part: RMCF0603FT10M0CT-ND; Supplier: Digi-Key; Contributor: LCEDA_Lib; Manufacturer Part: RMCF0603FT10M0; Manufacturer: Stackpole Electronics Inc
U3 U11 = SN74LVC2G14DCKR(UMW): Supplier: Digi-Key; Supplier Part: 296-13011-1-ND; Manufacturer: Texas Instruments; Manufacturer Part: SN74LVC2G14DCKR; JLCPCB Part Class: Extended Part; Contributor: lcsc
U4 = ICM7555: Contributor: jonny0811; Manufacturer Part: ICM7555IBAZ-T; Supplier: Digi-Key; Supplier Part: ICM7555IBAZ-TCT-ND; Manufacturer: Renesas Electronics Corporation
U2 U5 U7 = MCP2551T-I/SN: Supplier: Digi-Key; Manufacturer: Microchip Technology; Supplier Part: MCP2561T-E/SNCT-ND; JLCPCB Part Class: Extended Part
U6 = SN74LVC1G32DCKR: Manufacturer: Texas Instruments; Supplier Part: 296-9848-1-ND; Supplier: Digi-Key; Contributor: seabo2002
U8 = D-AS321KTR-G1: Contributor: lcsc; Supplier: Digi-Key; Supplier Part: AS321KTR-G1DICT-ND; Manufacturer: Diodes Incorporated; Manufacturer Part: AS321KTR-G1; JLCPCB Part Class: Extended Part
R30 = R_0603_US: Supplier Part: RMCF0603FT2K20CT-ND; Supplier: Digi-Key; Contributor: LCEDA_Lib; Manufacturer Part: RMCF0603FT2K20; Manufacturer: Stackpole Electronics Inc
R34 R35 R42 = R_0603_US: Supplier Part: 311-1.00KHRCT-ND; Supplier: Digi-Key; Contributor: LCEDA_Lib; Manufacturer Part: RC0603FR-071KL; Manufacturer: YAGEO
U15 = 74HCT123D,652: Supplier: Digi-Key; Manufacturer: Nexperia USA Inc.; Manufacturer Part: 74HCT123D,653; Supplier Part: 1727-7300-1-ND; JLCPCB Part Class: Extended Part
U16 = SN74LVC1G14DBVR_C434069: Contributor: LCSC; Supplier: Digi-Key; Supplier Part: 296-11607-1-ND; Manufacturer: Texas Instruments; Manufacturer Part: SN74LVC1G14DBVR; JLCPCB Part Class: Extended Part
U17 U18 = SN74HC595DRG4: Contributor: LCSC; Supplier: Digi-Key; Supplier Part: 296-14857-1-ND; Manufacturer: Texas Instruments; Manufacturer Part: SN74HC595DR; JLCPCB Part Class: Extended Part
U19 = CD4029BM: Contributor: LCSC; Supplier: Digi-Key; Supplier Part: 296-38054-1-ND; Manufacturer: Texas Instruments; Manufacturer Part: CD4029BM96; JLCPCB Part Class: Extended Part
R13 R14 R45 = R_2512_US: Supplier Part: 311-270ARCT-ND; Supplier: Digi-Key; Contributor: LCEDA_Lib
R15 = R_2512_US: Supplier Part: A126416CT-ND; Supplier: Digi-Key; Contributor: LCEDA_Lib
R18 R19 = R_0603_US: Supplier Part: 311-100KHRCT-ND; Supplier: Digi-Key; Contributor: LCEDA_Lib; Manufacturer Part: RC0603FR-07100KL; Manufacturer: YAGEO
U9 = TL072IDR(UMW): Supplier: Digi-Key; Supplier Part: 296-7194-1-ND; Manufacturer: Texas Instruments; Manufacturer Part: TL072IDR; subpart_no: 1; JLCPCB Part Class: Extended Part
U10 = MCP6006UT-E/OT: Contributor: lcsc; Supplier: Digi-Key; Supplier Part: 150-MCP6006UT-E/OTCT-ND; Manufacturer: Microchip Technology; JLCPCB Part Class: Extended Part
U12 = SN74LVC2G00DCTR: Contributor: LCSC; Supplier: Digi-Key; Supplier Part: 296-13257-1-ND; Manufacturer: Texas Instruments; JLCPCB Part Class: Extended Part
U13 = SN74LVC1G08DCKR: Supplier: Digi-Key; Manufacturer: Texas Instruments; Supplier Part: 296-11602-1-ND; JLCPCB Part Class: Extended Part
D7 = 1N4148: Supplier: Digi-Key; Supplier Part: SD103AWSTPMSCT-ND; Manufacturer: Micro Commercial Co; Contributor: LCSC
J3 = MX34012NF1_C9900019510: Contributor: lcsc; Supplier: Digi-Key; Supplier Part: 670-2285-ND; Manufacturer: JAE Electronics; Manufacturer Part: MX34012NF1; JLCPCB Part Class: Extended Part
J4 = 53254-0270: sourceId: EOM8Iht3D; Manufactuer: Molex; Manufacturer Part: 0532540270; Link: https://www.digikey.com/products/en?keywords=53254-0270; Digikey: WM18999-ND; Avnet: 0532540270; Supplier Part: WM18999-ND; Supplier: Digi-Key; Manufacturer: Molex
J6 = 0559350310: Manufacturer: Molex; Supplier: Digi-Key; Supplier Part: WM12297-ND; link: https://www.digikey.fr/products/fr?keywords=559350310; Contributor: rom1nux
U14 = DG413DY-T1-E3: Contributor: LCSC; Supplier: Digi-Key; Manufacturer: Vishay Siliconix; Supplier Part: DG413DY-T1-E3CT-ND; JLCPCB Part Class: Extended Part
C12 C13 = C_0603_US: Supplier Part: 1292-1500-2-ND; Supplier: Digi-Key; Contributor: LCEDA_Lib; Manufacturer Part: 0603N220F500CT; Manufacturer: Walsin Technology Corporation
D5 = -: catid: 20; Manufacturer Part: LTL-4233; Supplier: Digi-Key; Supplier Part: 160-1130-ND; Manufacturer: Lite-On Inc.
D6 = -: catid: 20; Manufacturer Part: LTL-4273; Supplier: Digi-Key; Supplier Part: 160-1966-ND; Manufacturer: Lite-On Inc.
J5 = HDR-M-2.54_1x8: Supplier Part: SAM8996-ND; Supplier: Digi-Key; Manufacturer: Samtec Inc.; Manufacturer Part: TSW-104-07-F-D; Contributor: LCEDA_Lib
R38 R39 = R_0603_US: Supplier Part: 311-150HRCT-ND; Supplier: Digi-Key; Contributor: LCEDA_Lib; Manufacturer Part: RC0603FR-07150RL; Manufacturer: YAGEO
U1 = ATMEGA2560-16AU: Supplier Part: ATMEGA1280-16AU-ND; Supplier: Digi-Key; Contributor: projetos hospitalar; Manufacturer: Microchip Technology
U22 = SN74LVC1G332DBVR: Supplier: Digi-Key; Manufacturer: Texas Instruments; Supplier Part: 296-18587-1-ND; JLCPCB Part Class: Extended Part
X1 = ECS-160-20-3X-EN-TR: Contributor: lcsc; Supplier: Digi-Key; Supplier Part: XC1793CT-ND; Manufacturer: ECS Inc.; JLCPCB Part Class: Extended Part; link: https://lcsc.com/eda_search?q=C2441296&%26type=1&ref=editor
C1-C4 C10 = CE_TH_D6.3×F2.5_US: Supplier Part: 399-6650-1-ND; Supplier: Digi-Key; Contributor: LCEDA_Lib; Manufacturer Part: ESK107M025AE3EA; Manufacturer: KEMET
D1 = BZT52C12-TP: Contributor: LCSC; Supplier: Digi-Key; Supplier Part: MMSZ5232BT1GOSCT-ND; Manufacturer: onsemi; Manufacturer Part: MMSZ5232BT1G; JLCPCB Part Class: Extended Part
D2 = BZT52C12-TP: Contributor: LCSC; Supplier: Digi-Key; Supplier Part: MMSZ4685-TPMSCT-ND; Manufacturer: Micro Commercial Co; Manufacturer Part: MMSZ4685-TP; JLCPCB Part Class: Extended Part
D3 D4 = BZT52C12-TP: Contributor: LCSC; Supplier: Digi-Key; Supplier Part: MMSZ4692T1GOSCT-ND; Manufacturer: onsemi; Manufacturer Part: MMSZ4692T1G; JLCPCB Part Class: Extended Part
J1 = 0430450601: Supplier: Digi-Key; Supplier Part: WM4037-ND; Manufacturer: MOLEX; Contributor: justinrehak; JLCPCB Part Class: Extended Part
J2 = 5-103166-2: Contributor: LCSC; Supplier: Digi-Key; Supplier Part: A33079-ND; Manufacturer: TE Connectivity AMP Connectors; JLCPCB Part Class: Extended Part
L1-L4 = L0603_US: Supplier Part: 445-174936-1-ND; Supplier: Digi-Key; Contributor: LCEDA_Lib; Manufacturer Part: MAF1608FAD151CT000; Manufacturer: TDK Corporation
C42 C43 = C_0603_US: Supplier Part: 1276-1037-1-ND; Supplier: Digi-Key; Contributor: LCEDA_Lib; Manufacturer Part: CL10C470JB8NNNC; Manufacturer: Samsung Electro-Mechanics
R32 R33 = R_0603_US: Supplier Part: 311-27.0HRCT-ND; Supplier: Digi-Key; Contributor: LCEDA_Lib; Manufacturer Part: RC0603FR-0727RL; Manufacturer: YAGEO
U20 = FT231XS-R: Contributor: LCSC; Supplier: Digi-Key; Manufacturer: FTDI; Supplier Part: 768-1129-1-ND; JLCPCB Part Class: Extended Part
U21 = SN74LVC2G14DBVR(MS): Supplier: Digi-Key; Supplier Part: 296-13010-1-ND; Manufacturer: Texas Instruments; Manufacturer Part: SN74LVC2G14DBVR; JLCPCB Part Class: Extended Part; Contributor: lcsc
USB1 = USB3080: Manufacturer: GCT; Manufacturer Part: USB3080-30-01-A; Supplier: Digi-Key; Supplier Part: 2073-USB3080-30-01-ACT-ND; link: https://www.mouser.es/ProductDetail/GCT/USB3080-30-01-A?qs=KUoIvG%2F9IlaAGOe2PsMLCQ%3D%3D; Contributor: Adrià Bubi

## Nets
2V5_LI: R18.1 U9.5(+IN2) U10.3(IN-) U10.4(OUT)
2V5_REF: R10.2 R11.1 U8.3(-IN)
+3.3V: C2.1 C6.2 D2.1(K) Q2.2(S) Q7.2(S) R5.1
+3V3_IN: J1.4 Q2.3(D)
+3V3S: C40.2 Q7.3(D) R36.2 R37.2 U20.15(VCC)
+5V: C1.1 C5.2 C11.2 C19.2 C20.2 C23.2 D1.1(K) Q1.2(S) Q8.2(S) R1.1 R2.1 R3.1 R8.1 R10.1 U3.5(VCC) U4.4(RST) U4.8(VDD) U5.3(VDD) U6.5(V)
+5V_IN: J1.1 Q1.3(D)
+5VS: C14.2 C15.2 C16.2 C17.2 C18.2 C24.2 C25.2 C26.2 C27.2 C28.2 C32.2 C34.2 C36.2 C37.2 C38.2 C44.2 C45.2 J5.7 L1.1 Q8.3(D) R23.1 R27.1 R30.1 R38.2 R39.2 R42.1 R44.1 U1.10(VCC) U1.31(VCC) U1.61(VCC) U1.80(VCC) U1.100(AVCC) U2.3(VDD) U7.3(VDD) U9.8(VCC) U10.5(V+) U11.5(VCC) U12.8(VCC) U13.5(VCC) U15.10(2B) U15.16(VCC) U16.5(VCC) U17.16(VCC) U18.16(VCC) U19.9(BD) U19.10(UD) U19.16(VDD) U21.5(VCC) U22.5(VCC)
+6V: C3.1 C7.2 D3.1(K) Q3.2(S) Q12.2(S) R6.1 U8.5(V+)
+6V_IN: J1.5 Q3.3(D)
+6VS: L3.1 Q12.3(D)
+12V: C9.2 C10.1 J3.12 Q5.2(S) Q15.2(S) R28.1
+12V_IN: J1.3 Q5.3(D)
+A6V: C30.1 L3.2 U14.13(V+)
+AVDD: C31.1 L1.2 U14.12(VL)
-6V: C4.2 C8.2 D4.2(A) Q4.2(S) Q13.2(S) R7.1 U8.2(V-)
-6V_IN: J1.2 Q4.3(D)
-6VS: L4.1 Q13.3(D)
-A6V: C29.1 L4.2 U14.4(V-)
AGND: C29.2 C30.2 C31.2 L2.2 U14.5(GND)
GND: C1.2 C2.2 C3.2 C4.1 C5.1 C6.1 C7.1 C8.1 C9.1 C10.2 C11.1 C12.1 C13.1 C14.1 C15.1 C16.1 C17.1 C18.1 C19.1 C20.1 C21.2 C22.1 C23.1 C24.1 C25.1 C26.1 C27.1 C28.1 C32.1 C33.1 C34.1 C35.1 C36.1 C37.1 C38.1 C39.1 C40.1 C42.2 C43.2 C44.1 C45.1 D1.2(A) D2.2(A) D3.2(A) D4.1(K) J1.6 J2.4 J3.2 J3.5 J3.6 J5.8 L2.1 Q1.1(G) Q2.1(G) Q3.1(G) Q4.1(G) Q5.1(G) Q6.2(S) Q9.2(S) Q10.2(S) Q11.2(S) Q14.2(S) Q16.2(S) Q17.2(S) Q18.2(S) Q19.2(S) Q20.2(S) Q21.2(S) R4.2 R9.2 R11.2 R12.1 R22.2 R24.2 R25.2 R26.2 R29.2 R31.2 R40.2 R41.2 R43.2 R46.2 U1.11(GND) U1.32(GND) U1.62(GND) U1.81(GND) U1.99(GND) U2.2(VSS) U3.2(GND) U4.1(GND) U5.2(VSS) U6.3(G) U7.2(VSS) U9.4(GND) U10.2(V-) U11.2(GND) U12.4(GND) U13.3(GND) U15.1(1A#) U15.6(2Cext) U15.8(GND) U15.14(1Cext) U16.3(GND) U17.8(GND) U17.13(OE#) U18.8(GND) U18.13(OE#) U19.3(J4) U19.4(J1) U19.5(C_IN) U19.8(VSS) U19.12(J2) U19.13(J3) U20.6(GND) U20.16(GND) U21.2(GND) U22.2(GND) USB1.5(GND) USB1.6(SH1) USB1.7(SH2)
/AI_RX: Q9.1(G) U3.6(Y1#)
/CNT_CLEAR: U16.4(Y) U17.10(SRCLR#) U18.10(SRCLR#)
/FULL_POWER_ON: R4.1 U3.4(Y2#) U5.8(RS)
/IE_CLK: U15.4(1Q#) U17.11(SRCLK) U18.11(SRCLK)
/IE_RX: R44.2 U7.4(RXD) U11.3(A2) U12.1(1A) U17.14(SER)
/IE_TX: U2.1(TXD) U7.1(TXD) U11.6(Y1#) U13.2(B)
/L_CLK: U15.12(2Q#) U17.12(RCLK) U18.12(RCLK) U19.15(CLOCK)
AI_RX: R1.2 U1.6(/OC3BINT4/PE4) U1.45(/RXD1INT2/PD2) U3.1(A1) U4.2(TRIG) U5.4(RXD)
AI_TX: R2.2 U1.46(/TXD1INT3/PD3) U5.1(TXD)
AIBUS+: J2.6 U5.7(CANH)
AIBUS-: J2.3 U5.6(CANL)
AIBUS_IN_L+: J2.8 U14.10(D3)
AIBUS_IN_L-: J2.1 U14.2(D1)
AIBUS_IN_R+: J2.7 U14.7(D4)
AIBUS_IN_R-: J2.2 U14.15(D2)
AUDIO_ON: R29.1 U1.12(/RXD2/PH0) U14.1(IN1) U14.8(IN4) U14.9(IN3) U14.16(IN2)
CLK: J5.3 U1.20(/SCKPCINT1/PB1)
FULL_POWER_ON: Q6.1(G) Q10.1(G) Q11.1(G) R9.1 U3.3(A2) U6.4(Y) U8.1(+IN)
GA_AUDIO_L+: J3.9 U14.11(S3)
GA_AUDIO_L-: J3.3 U14.3(S1)
GA_AUDIO_R+: J3.10 U14.6(S4)
GA_AUDIO_R-: J3.4 U14.14(S2)
GA_ON_DRAIN: D7.2 J3.8 Q14.3(D)
GA_ON_GATE: Q14.1(G) Q18.1(G) R40.1 U1.1(/OC0B/PG5)
GAH_CNT_0: U1.23(/OC2APCINT4/PB4) U19.6(Q1)
GAH_CNT_1: U1.24(/OC1APCINT5/PB5) U19.11(Q2)
GAH_CNT_2: U1.25(/OC1BPCINT6/PB6) U19.14(Q3)
GAH_CNT_3: U1.26(/OC0AOC1CPCINT7/PB7) U19.2(Q4)
GAH_CNT_CLEAR: R31.1 U1.52(PG1/RD) U16.2(A) U19.1(PE)
GAH_CNT_EN: U1.51(PG0/WR) U15.3(1RD#) U15.11(2RD#)
GAH_READ_0: U1.78(PA0/AD0) U17.15(QA)
GAH_READ_1: U1.77(PA1/AD1) U17.1(QB)
GAH_READ_2: U1.76(PA2/AD2) U17.2(QC)
GAH_READ_3: U1.75(PA3/AD3) U17.3(QD)
GAH_READ_4: U1.74(PA4/AD4) U17.4(QE)
GAH_READ_5: U1.73(PA5/AD5) U17.5(QF)
GAH_READ_6: U1.72(PA6/AD6) U17.6(QG)
GAH_READ_7: U1.71(PA7/AD7) U17.7(QH)
GAH_READ_8: U1.53(PC0/A8) U18.15(QA)
GAH_READ_9: U1.54(PC1/A9) U18.1(QB)
GAH_READ_10: U1.55(PC2/A10) U18.2(QC)
GAH_READ_11: U1.56(PC3/A11) U18.3(QD)
GAH_READ_12: U1.57(PC4/A12) U18.4(QE)
GAH_READ_13: U1.58(PC5/A13) U18.5(QF)
GAH_READ_14: U1.59(PC6/A14) U18.6(QG)
GAH_READ_15: U1.60(PC7/A15) U18.7(QH)
IE_CLK: U15.9(2A#) U15.13(1Q)
IE_DATA_CARRY: U17.9(QH') U18.14(SER)
IE_RX: R25.1 U1.16(/OC4B/PH4) U11.4(Y2#) U15.2(1B) U22.1(A)
IE_TX: R26.1 U1.15(/OC4A/PH3) U11.1(A1)
IEBUS+: J3.7 R13.1 R15.2 R17.2
IEBUS-: J3.1 R14.1 R15.1 R16.2
ILL_ANODE_GATE: Q16.1(G) R43.1 U1.5(/OC3AAIN1/PE3)
ILL_CATHODE_DRAIN: J4.2 Q17.3(D)
ILL_CATHODE_GATE: Q17.1(G) R41.1 U1.18(/OC2B/PH6)
PICO: J5.2 U1.22(/MISOPCINT3/PB3)
POCI: J5.1 U1.21(/MOSIPCINT2/PB2)
POWER_ON: U1.64(PJ1/TXD3PCINT10) U6.1(A)
POWER_PULSE: U4.3(OUT) U6.2(B)
PROG_D+: C42.1 R33.1 USB1.3(D+)
PROG_D-: C43.1 R32.1 USB1.2(D-)
PROG_RX: J5.5 R34.1 U1.2(/RXD0PCINT8/PE0)
PROG_RX_IND: U21.6(1Y) U22.3(B)
PROG_TX: J5.4 R35.2 U1.3(/TXD0/PE1)
PROG_TX_IND: U21.4(2Y) U22.6(C)
REC_CLEAR: R27.2 U1.13(/TXD2/PH1) U13.1(A)
REC_SET: U1.63(PJ0/RXD3PCINT9) U12.6(2B) U12.7(1Y)
RESET: C41.1 J5.6 U1.30(RESET)
TRUNK_OPEN_GATE: Q20.1(G) Q21.1(G) R46.1 U1.44(/SDAINT1/PD1)
XTAL1: C13.2 U1.34(XTAL1) X1.1(In/Out)
Net-(C12-2): C12.2 U1.33(XTAL2) X1.2(Out/In)
Net-(C21-1): C21.1 Q9.3(D) R8.2 U4.6(THR) U4.7(DIS)
Net-(C22-2): C22.2 U4.5(C/V)
Net-(C33-2): C33.2 R30.2 U15.15(1Rext/Cext)
Net-(C35-2): C35.2 R42.2 U15.7(2Rext/Cext)
Net-(C39-2): C39.2 U20.3(VCCIO) U20.13(3V3OUT) U20.14(RESET#)
Net-(C41-2): C41.2 U20.1(DTR#)
Net-(D5-1): D5.1(ANODE) R38.1
Net-(D5-2): D5.2(CATHODE) Q18.3(D)
Net-(D6-1): D6.1(ANODE) R39.1
Net-(D6-2): D6.2(CATHODE) Q19.3(D)
Net-(D7-1): D7.1 J6.2 Q20.3(D)
Net-(J4-1): J4.1 Q15.3(D)
Net-(J6-3): J6.3 Q21.3(D)
Net-(Q6-3): Q6.3(D) Q7.1(G) R5.2
Net-(Q8-1): Q8.1(G) Q10.3(D) R3.2
Net-(Q11-3): Q11.3(D) Q12.1(G) R6.2
Net-(Q13-1): Q13.1(G) R7.2 U8.4(OUT)
Net-(Q15-1): Q15.1(G) Q16.3(D) R28.2
Net-(Q19-1): Q19.1(G) U22.4(Y)
Net-(R12-2): R12.2 U2.8(RS)
Net-(R13-2): R13.2 U2.7(CANH)
Net-(R14-2): R14.2 U2.6(CANL)
Net-(R16-1): R16.1 R19.2 U9.2(-IN1)
Net-(R17-1): R17.1 R18.2 U9.3(+IN1)
Net-(R19-1): R19.1 R20.2 R45.2 U7.7(CANH) U9.1(OUT1)
Net-(R20-1): R20.1 R21.2 U9.6(-IN2)
Net-(R21-1): R21.1 R45.1 U7.6(CANL) U9.7(OUT2)
Net-(R22-1): R22.1 U7.8(RS)
Net-(R23-2): R23.2 R24.1 U10.1(IN+)
Net-(R32-2): R32.2 U20.12(USBDM)
Net-(R33-2): R33.2 U20.11(USBDP)
Net-(R34-2): R34.2 U20.20(TXD)
Net-(R35-1): R35.1 U20.4(RXD)
Net-(R36-1): R36.1 U20.17(CBUS1) U21.1(1A)
Net-(R37-1): R37.1 U20.10(CBUS2) U21.3(2A)
Net-(U12-2): U12.2(1B) U12.3(2Y)
Net-(U12-5): U12.5(2A) U13.4(Y)

Not connected (* = marked no-connect by the designer): J2 5*; J3 11*; J6 1*; U1 4(/XCK0AIN0/PE2)* 7(/OC3CINT5/PE5)* 8(/T3INT6/PE6)* 9(/CLKOICP3INT7/PE7)* 14(/XCK2/PH2)* 17(/OC4C/PH5)* 19(/SSPCINT0/PB0)* 27(/T4/PH7)* 28(/TOSC2/PG3)* 29(/TOSC1/PG4)* 35(/ICP4/PL0)* 36(/ICP5/PL1)* 37(/T5/PL2)* 38(/OC5A/PL3)* 39(/OC5B/PL4)* 40(OC5C/PL5)* 41(PL6)* 42(PL7)* 43(/SCLINT0/PD0)* 47(/ICP1/PD4)* 48(/XCK1/PD5)* 49(/T1/PD6)* 50(/T0/PD7)* 65(PJ2/XCK3PCINT11)* 66(PJ3/PCINT12)* 67(PJ4/PCINT13)* 68(PJ5/PCINT14)* 69(PJ6/PCINT15)* 70(PG2/ALE)* 79(PJ7)* 82(PK7/ADC15PCINT23)* 83(PK6/ADC14PCINT22)* 84(PK5/ADC13PCINT21)* 85(PK4/ADC12PCINT20)* 86(PK3/ADC11PCINT19)* 87(PK2/ADC10PCINT18)* 88(PK1/ADC9PCINT17)* 89(PK0/ADC8PCINT16)* 90(PF7/ADC7TDI)* 91(PF6/ADC6TDO)* 92(PF5/ADC5TMS)* 93(PF4/ADC4TCK)* 94(PF3/ADC3)* 95(PF2/ADC2)* 96(PF1/ADC1)* 97(PF0/ADC0)* 98(AREF)*; U2 4(RXD)* 5(VREF)*; U5 5(VREF)*; U7 5(VREF)*; U15 5(2Q)*; U16 1(NC)*; U18 9(QH')*; U19 7(C_Out)*; U20 2(RTS#)* 5(RI#)* 7(DSR#)* 8(DCD#)* 9(CTS#)* 18(CBUS0)* 19(CBUS3)*; USB1 1(VCC)* 4(ID)*

## Notes on the sheets
sheet 1
- Power Connector
- AIBus Connector
sheet 2
- Active Low
